# EAGLE design GEVCU 3 (EAGLE 6.1)
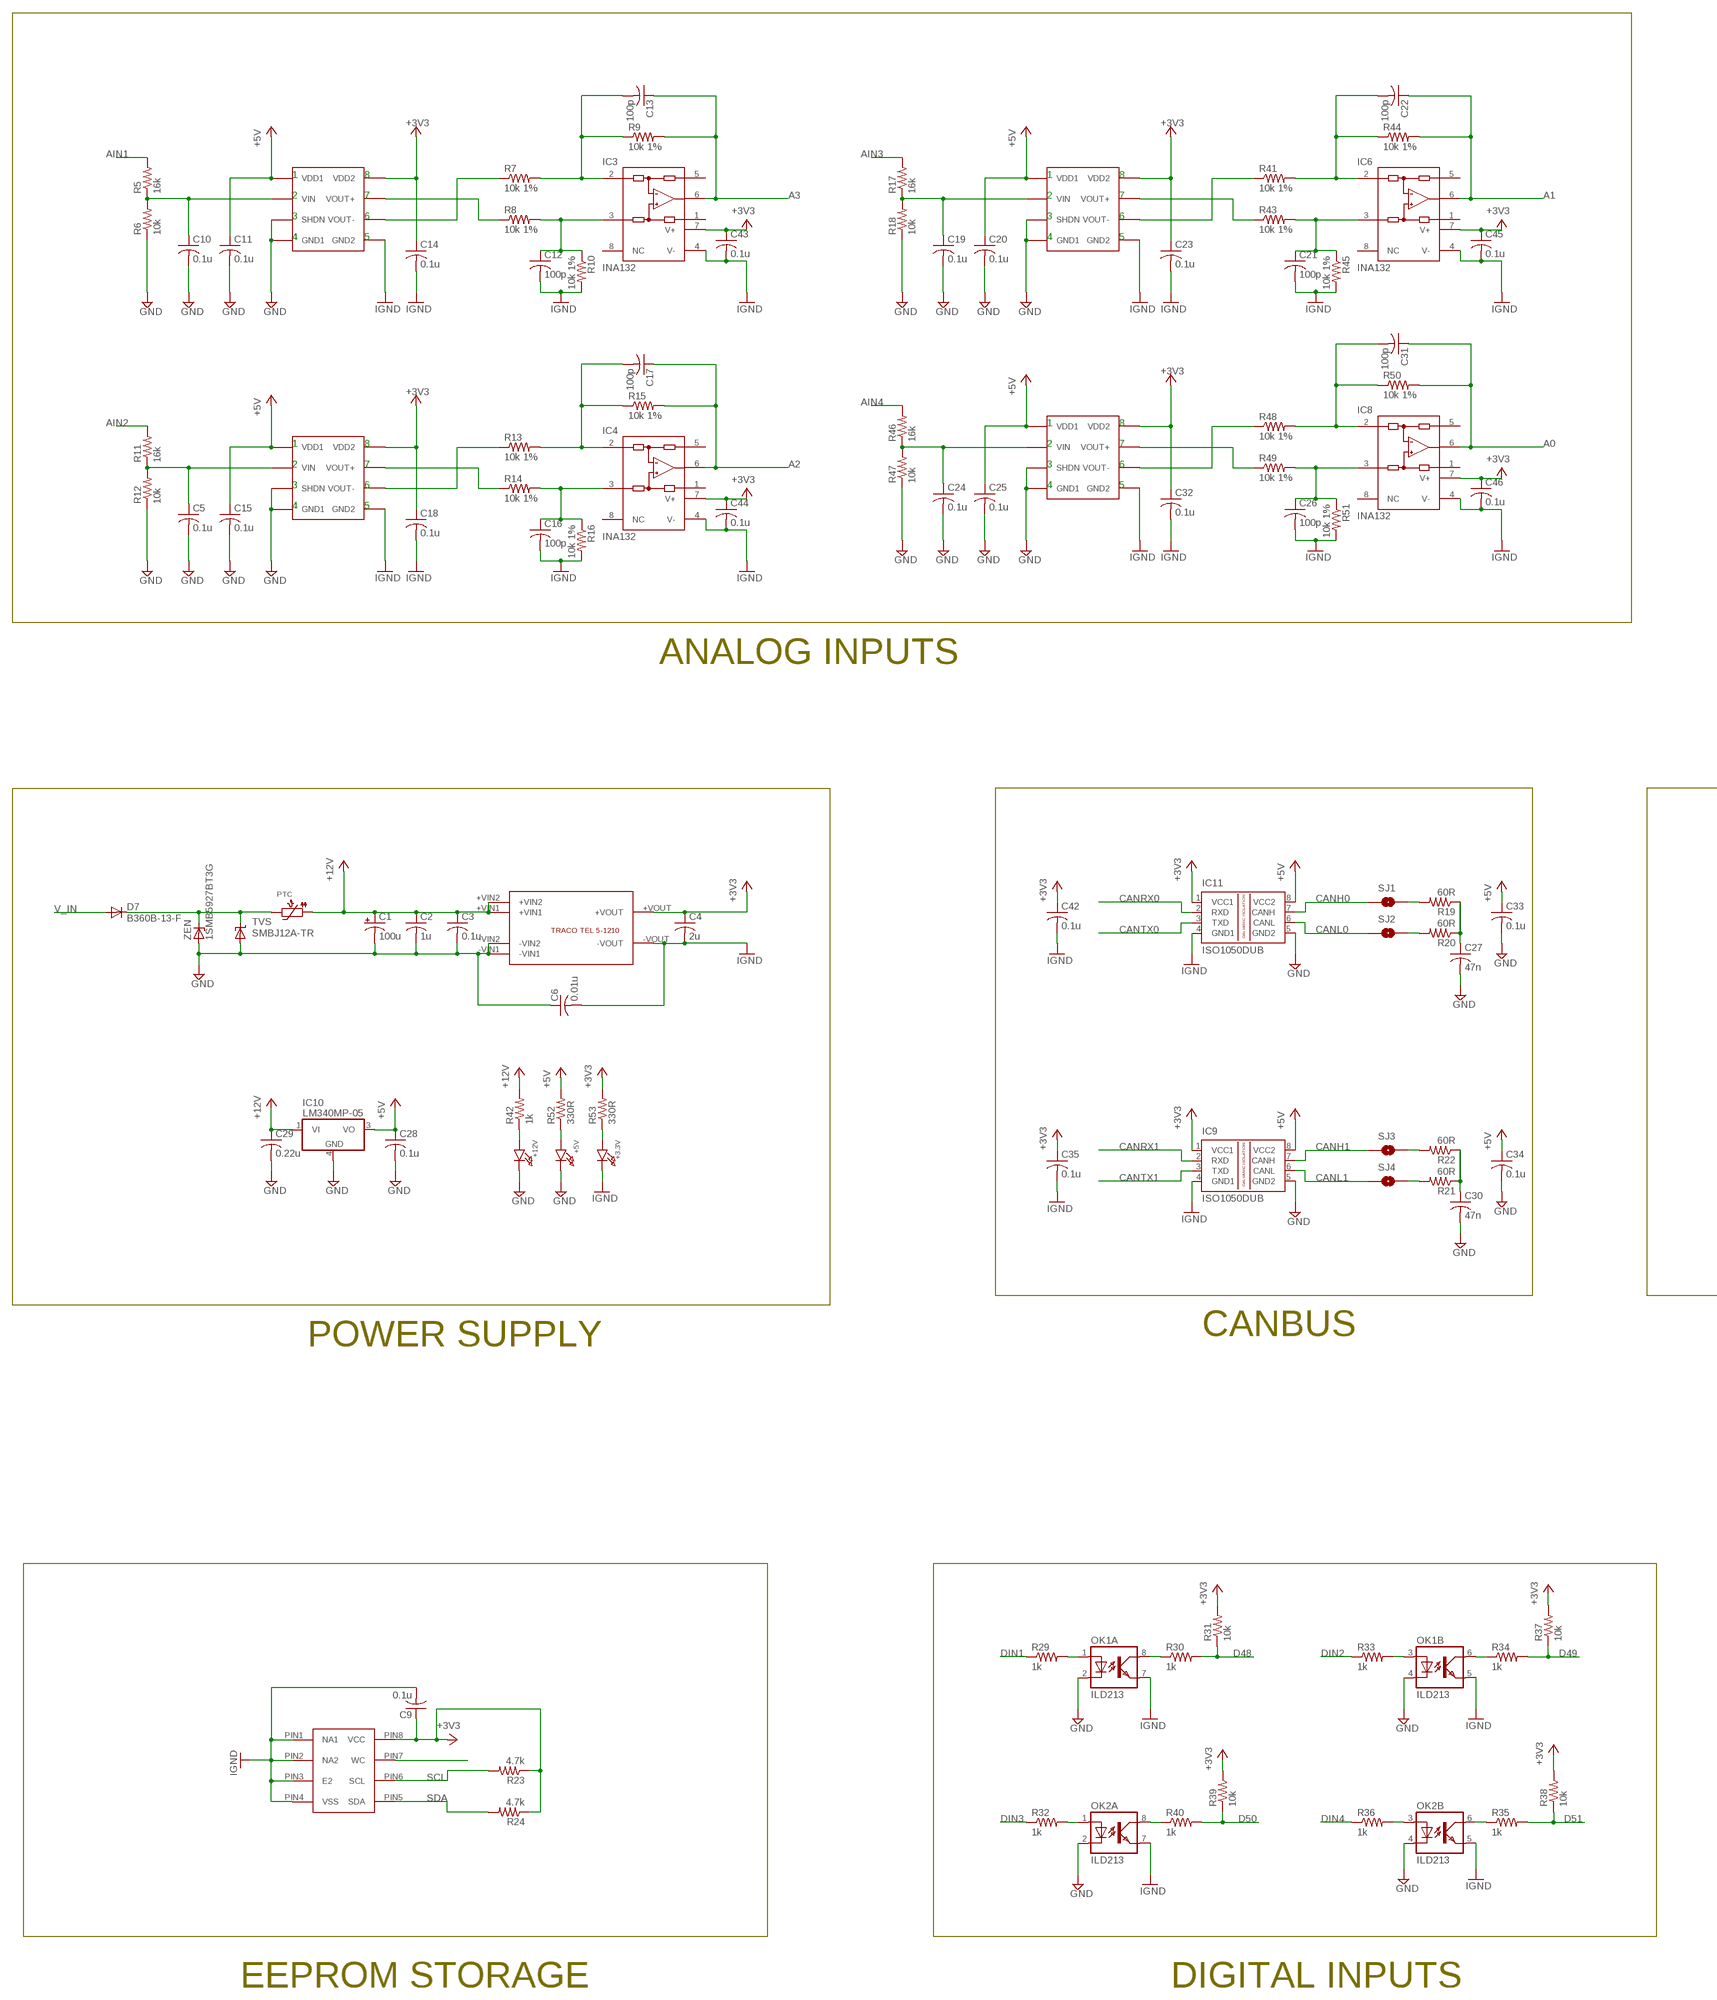
[diagram p0: schematic, sheet 1, part 1 of 2]
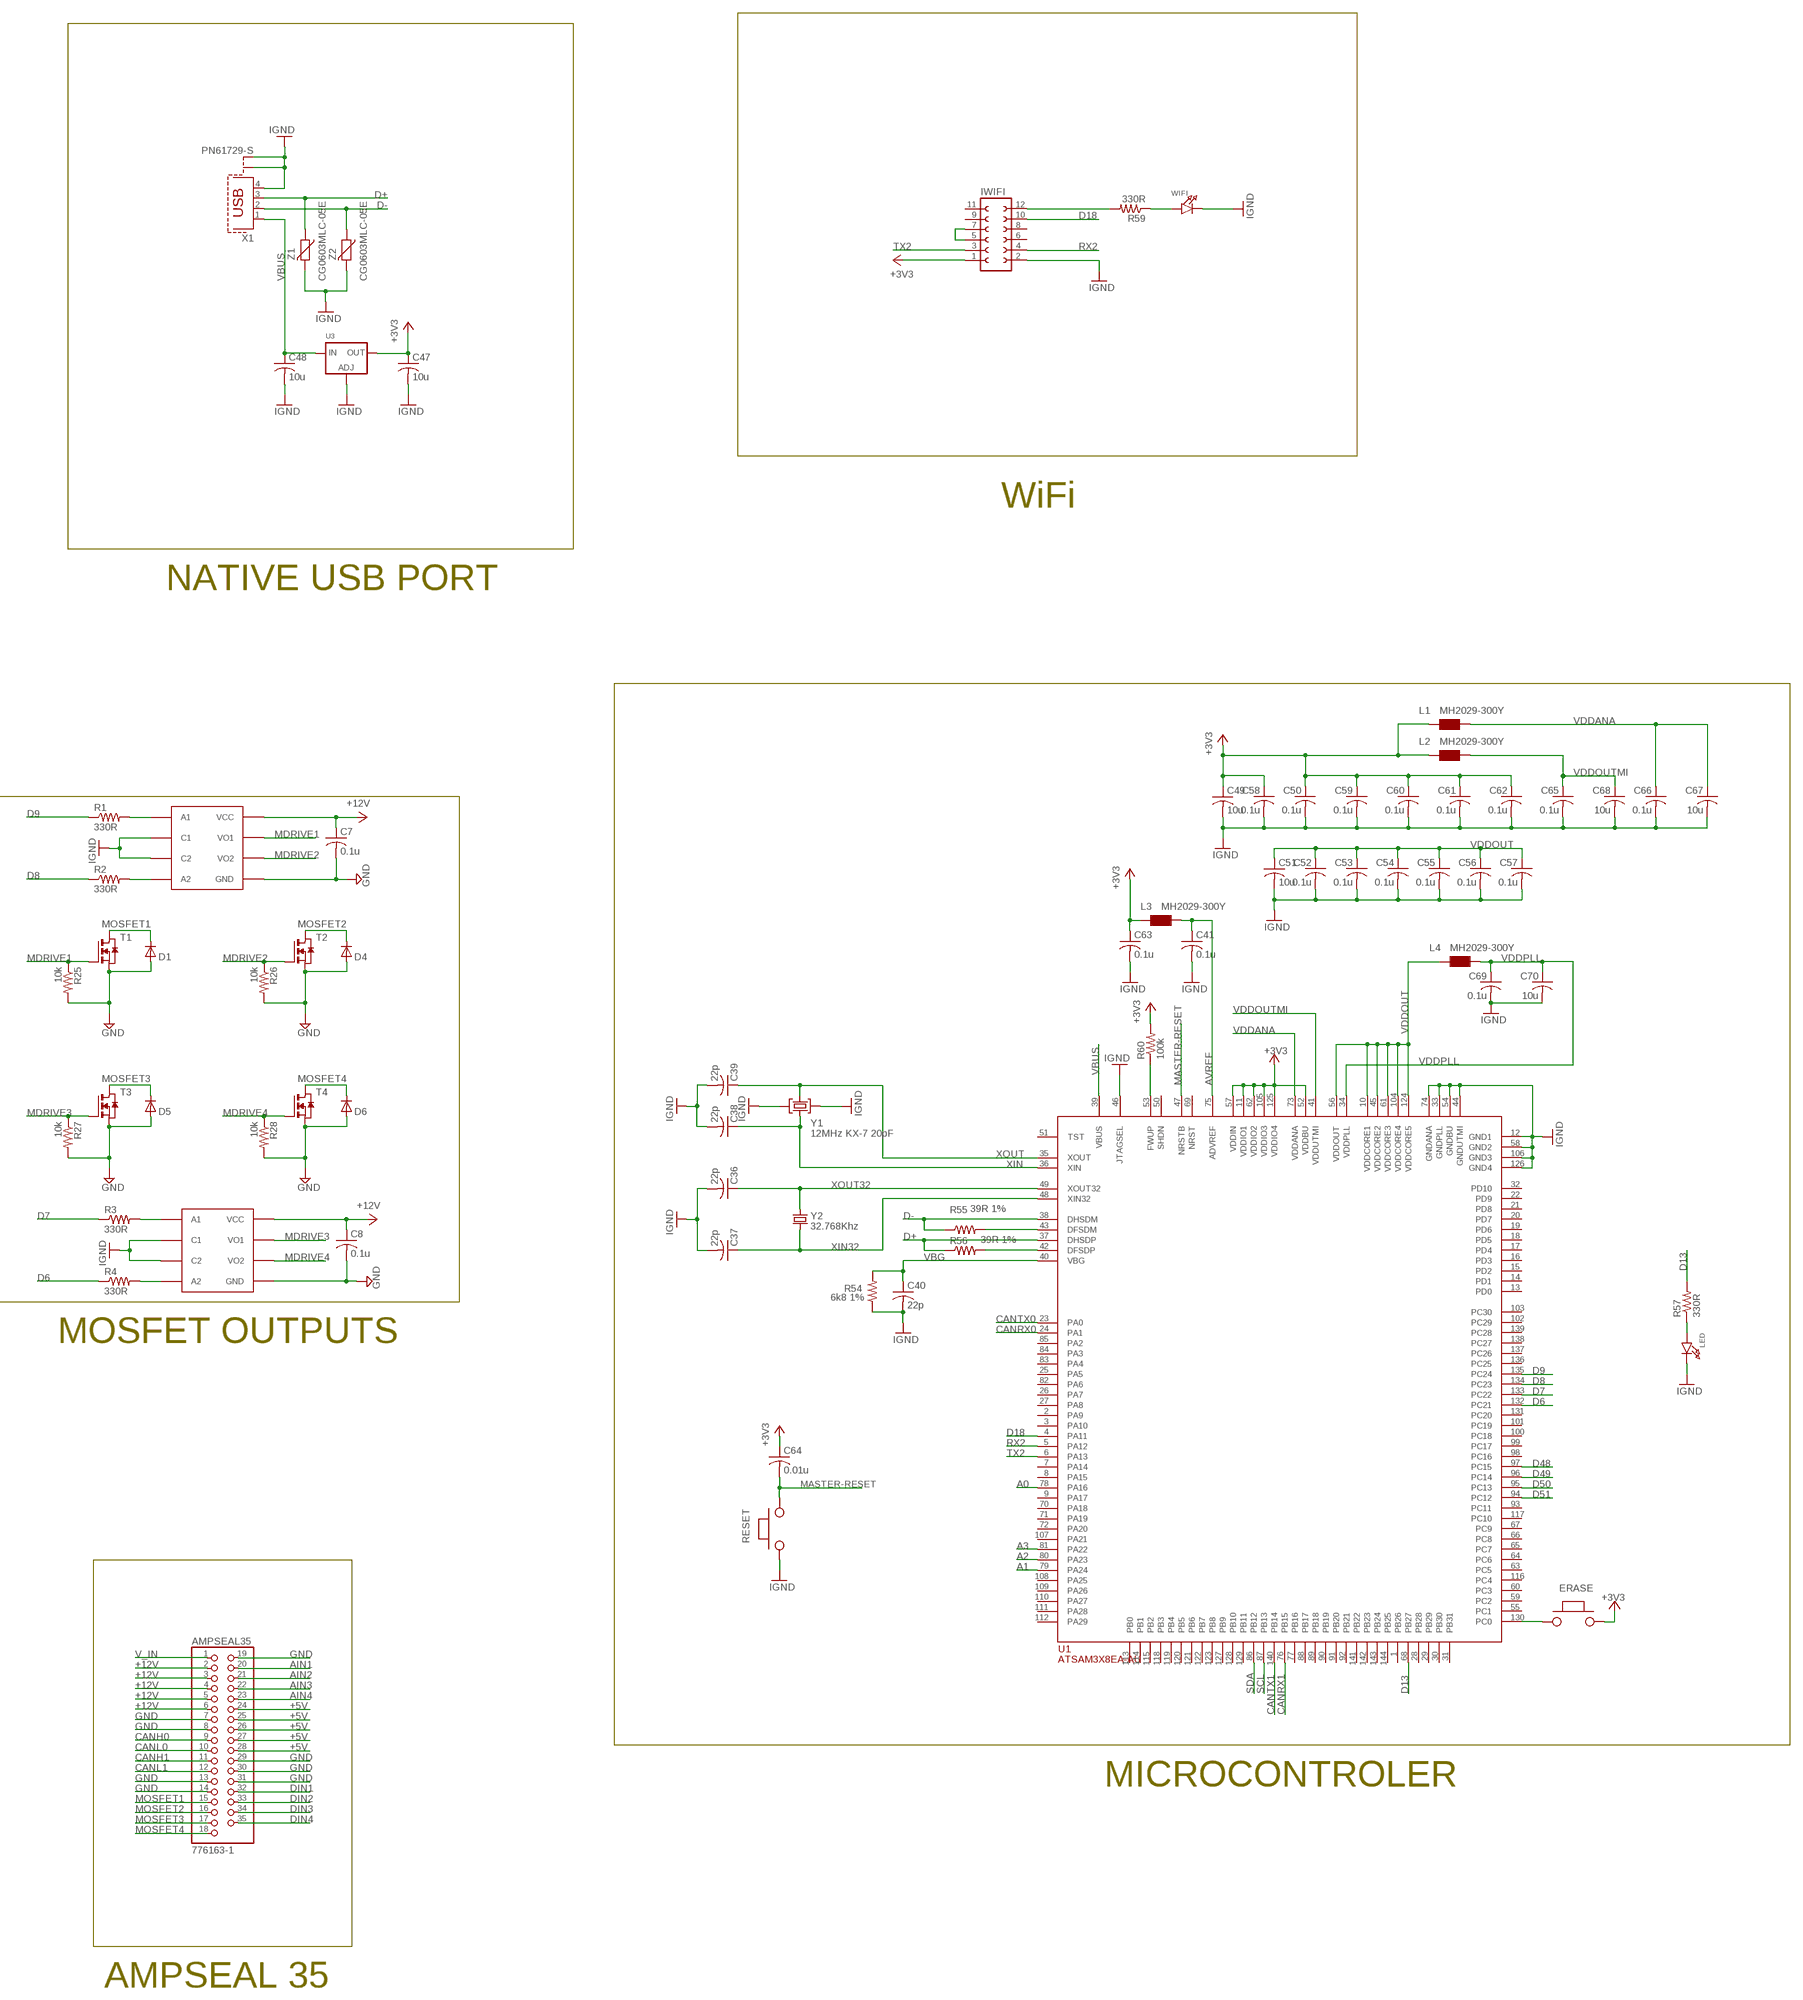
[diagram p1: schematic, sheet 1, part 2 of 2]

## Parts
+3.3V  LED0805  [CHIPLED_0805]
+5V  LED0805  [CHIPLED_0805]
+12V  LED0805  [CHIPLED_0805]
AMPSEAL35  776163-1  AMPSEAL35  [AMPSEAL35]
C1  100u  CPOL-USE2.5-6  [E2,5-6]
C2  1u  C-USC0805  [C0805]
C3  0.1u  C-USC0805  [C0805]
C4  2u  C-USC0805  [C0805]
C5  0.1u  C-USC0805  [C0805]
C6  0.01u  C-USC1812  [C1812]
C7  0.1u  C-USC0805  [C0805]
C8  0.1u  C-USC0805  [C0805]
C9  0.1u  C-USC0805  [C0805]
C10  0.1u  C-USC0805  [C0805]
C11  0.1u  C-USC1206  [C1206]
C12  100p  C-USC0805  [C0805]
C13  100p  C-USC0805  [C0805]
C14  0.1u  C-USC0805  [C0805]
C15  0.1u  C-USC1206  [C1206]
C16  100p  C-USC0805  [C0805]
C17  100p  C-USC0805  [C0805]
C18  0.1u  C-USC0805  [C0805]
C19  0.1u  C-USC0805  [C0805]
C20  0.1u  C-USC1206  [C1206]
C21  100p  C-USC0805  [C0805]
C22  100p  C-USC0805  [C0805]
C23  0.1u  C-USC0805  [C0805]
C24  0.1u  C-USC0805  [C0805]
C25  0.1u  C-USC1206  [C1206]
C26  100p  C-USC0805  [C0805]
C27  47n  C-USC0805  [C0805]
C28  0.1u  C-USC0805  [C0805]
C29  0.22u  C-USC0805  [C0805]
C30  47n  C-USC0805  [C0805]
C31  100p  C-USC0805  [C0805]
C32  0.1u  C-USC0805  [C0805]
C33  0.1u  C-USC0805  [C0805]
C34  0.1u  C-USC0805  [C0805]
C35  0.1u  C-USC0805  [C0805]
C36  22p  C-USC0805  [C0805]
C37  22p  C-USC0805  [C0805]
C38  22p  C-USC1206  [C1206]
C39  22p  C-USC1206  [C1206]
C40  22p  C-USC0805  [C0805]
C41  0.1u  C-USC0805  [C0805]
C42  0.1u  C-USC0805  [C0805]
C43  0.1u  C-USC0805  [C0805]
C44  0.1u  C-USC0805  [C0805]
C45  0.1u  C-USC0805  [C0805]
C46  0.1u  C-USC0805  [C0805]
C47  10u  C-USC0805  [C0805]
C48  10u  C-USC0805  [C0805]
C49  10u  C-USC0805  [C0805]
C50  0.1u  C-USC0805  [C0805]
C51  10u  C-USC0805  [C0805]
C52  0.1u  C-USC0805  [C0805]
C53  0.1u  C-USC0805  [C0805]
C54  0.1u  C-USC0805  [C0805]
C55  0.1u  C-USC0805  [C0805]
C56  0.1u  C-USC0805  [C0805]
C57  0.1u  C-USC0805  [C0805]
C58  0.1u  C-USC0805  [C0805]
C59  0.1u  C-USC0805  [C0805]
C60  0.1u  C-USC0805  [C0805]
C61  0.1u  C-USC0805  [C0805]
C62  0.1u  C-USC0805  [C0805]
C63  0.1u  C-USC0805  [C0805]
C64  0.01u  C-USC0805  [C0805]
C65  0.1u  C-USC0805  [C0805]
C66  0.1u  C-USC0805  [C0805]
C67  10u  C-USC0805  [C0805]
C68  10u  C-USC0805  [C0805]
C69  0.1u  C-USC0805  [C0805]
C70  10u  C-USC0805  [C0805]
D1  MBR0520LT  [SOD123]
D4  MBR0520LT  [SOD123]
D5  MBR0520LT  [SOD123]
D6  MBR0520LT  [SOD123]
D7  B360B-13-F  DIODE-SMB  [SMB]
ERASE  PUCHBUTTON  [PUCHBUTTON]
IC1  ACPL-C87A-000E  [SO8-WIDE]
IC2  ACPL-C87A-000E  [SO8-WIDE]
IC3  INA132  INA105U  [SO08]
IC4  INA132  INA105U  [SO08]
IC5  ACPL-C87A-000E  [SO8-WIDE]
IC6  INA132  INA105U  [SO08]
IC7  ACPL-C87A-000E  [SO8-WIDE]
IC8  INA132  INA105U  [SO08]
IC9  ISO1050DUB  [DUB-R-PDSO-G8]
IC10  LM340MP-05  [SOT223]
IC11  ISO1050DUB  [DUB-R-PDSO-G8]
IWIFI  FE06-2  [FE06-2]
L1  MH2029-300Y  WE-CBF_0805  [0805]
L2  MH2029-300Y  WE-CBF_0805  [0805]
L3  MH2029-300Y  WE-CBF_0805  [0805]
L4  MH2029-300Y  WE-CBF_0805  [0805]
LED  LED0805  [CHIPLED_0805]
OK1  ILD213  [SOIC08]
OK2  ILD213  [SOIC08]
PTC  PTC1812  [PTC1812]
R1  330R  R-US_R0805  [R0805]
R2  330R  R-US_R0805  [R0805]
R3  330R  R-US_R0805  [R0805]
R4  330R  R-US_R0805  [R0805]
R5  16k  R-US_R0805  [R0805]
R6  10k  R-US_R0805  [R0805]
R7  10k 1%  R-US_R0805  [R0805]
R8  10k 1%  R-US_R0805  [R0805]
R9  10k 1%  R-US_R0805  [R0805]
R10  10k 1%  R-US_R0805  [R0805]
R11  16k  R-US_R0805  [R0805]
R12  10k  R-US_R0805  [R0805]
R13  10k 1%  R-US_R0805  [R0805]
R14  10k 1%  R-US_R0805  [R0805]
R15  10k 1%  R-US_R0805  [R0805]
R16  10k 1%  R-US_R0805  [R0805]
R17  16k  R-US_R0805  [R0805]
R18  10k  R-US_R0805  [R0805]
R19  60R  R-US_R0805  [R0805]
R20  60R  R-US_R0805  [R0805]
R21  60R  R-US_R0805  [R0805]
R22  60R  R-US_R0805  [R0805]
R23  4.7k  R-US_R0805  [R0805]
R24  4.7k  R-US_R0805  [R0805]
R25  10k  R-US_R0805  [R0805]
R26  10k  R-US_R0805  [R0805]
R27  10k  R-US_R0805  [R0805]
R28  10k  R-US_R0805  [R0805]
R29  1k  R-US_R0805  [R0805]
R30  1k  R-US_R0805  [R0805]
R31  10k  R-US_R0805  [R0805]
R32  1k  R-US_R0805  [R0805]
R33  1k  R-US_R0805  [R0805]
R34  1k  R-US_R0805  [R0805]
R35  1k  R-US_R0805  [R0805]
R36  1k  R-US_R0805  [R0805]
R37  10k  R-US_R0805  [R0805]
R38  10k  R-US_R0805  [R0805]
R39  10k  R-US_R0805  [R0805]
R40  1k  R-US_R0805  [R0805]
R41  10k 1%  R-US_R0805  [R0805]
R42  1k  R-US_R0805  [R0805]
R43  10k 1%  R-US_R0805  [R0805]
R44  10k 1%  R-US_R0805  [R0805]
R45  10k 1%  R-US_R0805  [R0805]
R46  16k  R-US_R0805  [R0805]
R47  10k  R-US_R0805  [R0805]
R48  10k 1%  R-US_R0805  [R0805]
R49  10k 1%  R-US_R0805  [R0805]
R50  10k 1%  R-US_R0805  [R0805]
R51  10k 1%  R-US_R0805  [R0805]
R52  330R  R-US_R0805  [R0805]
R53  330R  R-US_R0805  [R0805]
R54  6k8 1%  R-US_R0805  [R0805]
R55  39R 1%  R-US_R0805  [R0805]
R56  39R 1%  R-US_R0805  [R0805]
R57  330R  R-US_R0805  [R0805]
R59  330R  R-US_R0805  [R0805]
R60  100k  R-US_R0805  [R0805]
RESET  PUCHBUTTON  [PUCHBUTTON]
SJ1  SOLDERJUMPERNO  [SJ_2S-NO]
SJ2  SOLDERJUMPERNO  [SJ_2S-NO]
SJ3  SOLDERJUMPERNO  [SJ_2S-NO]
SJ4  SOLDERJUMPERNO  [SJ_2S-NO]
T1  NMOSSOT223  [SOT223]
T2  NMOSSOT223  [SOT223]
T3  NMOSSOT223  [SOT223]
T4  NMOSSOT223  [SOT223]
TVS  SMBJ12A-TR  SUPPRESSOR-SMBJ  [SMBJ]
U1  ATSAM3X8EA-AU  ATSAM3X/AAU  [LQFP144]
U3  LM1117SOT223-WAVE  [SOT223-W]
U4  SFH6731  [DIP8]
U5  SFH6731  [DIP8]
U6  M24M02-DRMN6TP  [SOIC8]
U$2  TRACO  [TRACO]
WIFI  LED0805  [CHIPLED_0805]
X1  PN61729-S  [PN61729-S]
Y1  12MHz KX-7 20pF  CRYSTAL-3.2-2.5  [CRYSTAL-3.2-2.5]
Y2  32.768Khz  RESONATOR_EPSON_FC_145  [RESONATOR_EPSON_FC_145]
Z1  CG0603MLC-05E  VARISTORCN0603  [CT/CN0603]
Z2  CG0603MLC-05E  VARISTORCN0603  [CT/CN0603]
ZEN  1SMB5927BT3G  ZENER-DIODESMB  [SMB]

## Nets
+3V3: C4.1 C9.1 C14.1 C18.1 C23.1 C32.1 C35.1 C42.1 C43.1 C44.1 C45.1 C46.1 C47.1 C49.1 C50.1 C58.1 C59.1 C60.1 C61.1 C62.1 C63.1 C64.1 ERASE.P$2 IC1.8(VDD2) IC2.8(VDD2) IC3.7(V+) IC4.7(V+) IC5.8(VDD2) IC6.7(V+) IC7.8(VDD2) IC8.7(V+) IC9.1(VCC1) IC11.1(VCC1) IWIFI.1 L1.1 L2.1 L3.1 R23.1 R24.1 R31.2 R37.2 R38.2 R39.2 R53.2 R60.2 U1.11(VDDIO1) U1.52(VDDBU) U1.57(VDDIN) U1.62(VDDIO2) U1.105(VDDIO3) U1.125(VDDIO4) U3.2(OUT) U6.PIN8(VCC) U$2.+VOUT
+5V: AMPSEAL35.24 AMPSEAL35.25 AMPSEAL35.26 AMPSEAL35.27 AMPSEAL35.28 C11.1 C15.1 C20.1 C25.1 C28.1 C33.1 C34.1 IC1.1(VDD1) IC2.1(VDD1) IC5.1(VDD1) IC7.1(VDD1) IC9.8(VCC2) IC10.3(VO) IC11.8(VCC2) R52.2
+12V: AMPSEAL35.2 AMPSEAL35.3 AMPSEAL35.4 AMPSEAL35.5 AMPSEAL35.6 C1.+ C2.1 C3.1 C7.1 C8.1 C29.1 IC10.1(VI) PTC.P$1 R42.2 U4.8(VCC) U5.8(VCC) U$2.+VIN1 U$2.+VIN2
A0: C31.1 IC8.6(OUT) R50.2 U1.78(PA16)
A1: C22.1 IC6.6(OUT) R44.2 U1.79(PA24)
A2: C17.1 IC4.6(OUT) R15.2 U1.80(PA23)
A3: C13.1 IC3.6(OUT) R9.2 U1.81(PA22)
AIN1: AMPSEAL35.20 R5.2
AIN2: AMPSEAL35.21 R11.2
AIN3: AMPSEAL35.22 R17.2
AIN4: AMPSEAL35.23 R46.2
AVREF: C41.1 L3.2 U1.75(ADVREF)
CANH0: AMPSEAL35.9 IC11.7(CANH) SJ1.1
CANH1: AMPSEAL35.11 IC9.7(CANH) SJ3.1
CANL0: AMPSEAL35.10 IC11.6(CANL) SJ2.1
CANL1: AMPSEAL35.12 IC9.6(CANL) SJ4.1
CANRX0: IC11.2(RXD) U1.24(PA1)
CANRX1: IC9.2(RXD) U1.76(PB15)
CANTX0: IC11.3(TXD) U1.23(PA0)
CANTX1: IC9.3(TXD) U1.140(PB14)
D6: R4.1 U1.132(PC21)
D7: R3.1 U1.133(PC22)
D8: R2.1 U1.134(PC23)
D9: R1.1 U1.135(PC24)
D13: R57.2 U1.68(PB27)
D18: IWIFI.10 U1.4(PA11)
D48: R30.2 R31.1 U1.97(PC15)
D49: R34.2 R37.1 U1.96(PC14)
D50: R39.1 R40.2 U1.95(PC13)
D51: R35.2 R38.1 U1.94(PC12)
D+ [USB]: R56.1 U1.37(DHSDP) X1.3 Z1.1
D- [USB]: R55.1 U1.38(DHSDM) X1.2 Z2.1
DIN1: AMPSEAL35.32 R29.1
DIN2: AMPSEAL35.33 R33.1
DIN3: AMPSEAL35.34 R32.1
DIN4: AMPSEAL35.35 R36.1
ERASE_S: ERASE.P$1 U1.130(PC0)
GND: +5V.C +12V.C AMPSEAL35.7 AMPSEAL35.8 AMPSEAL35.13 AMPSEAL35.14 AMPSEAL35.19 AMPSEAL35.29 AMPSEAL35.30 AMPSEAL35.31 C1.- C2.2 C3.2 C5.2 C6.1 C7.2 C8.2 C10.2 C11.2 C15.2 C19.2 C20.2 C24.2 C25.2 C27.2 C28.2 C29.2 C30.2 C33.2 C34.2 D1.A D4.A D5.A D6.A IC1.3(SHDN) IC1.4(GND1) IC2.3(SHDN) IC2.4(GND1) IC5.3(SHDN) IC5.4(GND1) IC7.3(SHDN) IC7.4(GND1) IC9.5(GND2) IC10.4(GND) IC11.5(GND2) OK1.2(A:C) OK1.4(B:C) OK2.2(A:C) OK2.4(B:C) R6.1 R12.1 R18.1 R25.2 R26.2 R27.2 R28.2 R47.1 T1.3(S) T2.3(S) T3.3(S) T4.3(S) TVS.A U4.5(GND) U5.5(GND) U$2.-VIN1 U$2.-VIN2 ZEN.A
IGND: +3.3V.C C4.2 C6.2 C9.2 C12.2 C14.2 C16.2 C18.2 C21.2 C23.2 C26.2 C32.2 C35.2 C36.2 C37.2 C38.2 C39.2 C40.2 C41.2 C42.2 C43.2 C44.2 C45.2 C46.2 C47.2 C48.2 C49.2 C50.2 C51.2 C52.2 C53.2 C54.2 C55.2 C56.2 C57.2 C58.2 C59.2 C60.2 C61.2 C62.2 C63.2 C65.2 C66.2 C67.2 C68.2 C69.2 C70.2 IC1.5(GND2) IC2.5(GND2) IC3.4(V-) IC4.4(V-) IC5.5(GND2) IC6.4(V-) IC7.5(GND2) IC8.4(V-) IC9.4(GND1) IC11.4(GND1) IWIFI.2 LED.C OK1.5(B:EMIT) OK1.7(A:EMIT) OK2.5(B:EMIT) OK2.7(A:EMIT) R10.2 R16.2 R45.2 R51.2 R54.1 RESET.P$1 U1.12(GND1) U1.33(GNDPLL) U1.44(GNDUTMI) U1.46(JTAGSEL) U1.54(GNDBU) U1.58(GND2) U1.74(GNDANA) U1.106(GND3) U1.126(GND4) U3.1(ADJ) U4.2(C1) U4.3(C2) U5.2(C1) U5.3(C2) U6.PIN1(NA1) U6.PIN2(NA2) U6.PIN3(E2) U6.PIN4(VSS) U$2.-VOUT WIFI.C X1.4 X1.S1 X1.S2 Y1.2(GND) Y1.4(GND) Z1.2 Z2.2
MASTER-RESET: C64.2 RESET.P$2 U1.47(NRSTB)
MDRIVE1: R25.1 T1.1(G) U5.7(VO1)
MDRIVE2: R26.1 T2.1(G) U5.6(VO2)
MDRIVE3: R27.1 T3.1(G) U4.7(VO1)
MDRIVE4: R28.1 T4.1(G) U4.6(VO2)
MOSFET1: AMPSEAL35.15 D1.C T1.2(D) T1.4(D)
MOSFET2: AMPSEAL35.16 D4.C T2.2(D) T2.4(D)
MOSFET3: AMPSEAL35.17 D5.C T3.2(D) T3.4(D)
MOSFET4: AMPSEAL35.18 D6.C T4.2(D) T4.4(D)
N$1: C10.1 IC1.2(VIN) R5.1 R6.2
N$2: +3.3V.A R53.1
N$3: D7.C PTC.P$2 TVS.C ZEN.C
N$4: +5V.A R52.1
N$5: R3.2 U4.1(A1)
N$6: LED.A R57.1
N$7: R1.2 U5.1(A1)
N$8: IC2.7(VOUT+) R14.1
N$9: IC2.6(VOUT-) R13.1
N$10: R2.2 U5.4(A2)
N$11: R4.2 U4.4(A2)
N$12: C17.2 IC4.2(-IN) R13.2 R15.1
N$13: IC1.7(VOUT+) R8.1
N$14: IC1.6(VOUT-) R7.1
N$15: C13.2 IC3.2(-IN) R7.2 R9.1
N$16: C12.1 IC3.3(+IN) R8.2 R10.1
N$17: C16.1 IC4.3(+IN) R14.2 R16.1
N$18: C5.1 IC2.2(VIN) R11.1 R12.2
N$19: IC5.7(VOUT+) R43.1
N$20: IC5.6(VOUT-) R41.1
N$21: C22.2 IC6.2(-IN) R41.2 R44.1
N$22: C21.1 IC6.3(+IN) R43.2 R45.1
N$23: C19.1 IC5.2(VIN) R17.1 R18.2
N$24: C27.1 R19.1 R20.1
N$25: IC7.7(VOUT+) R49.1
N$26: R19.2 SJ1.2
N$27: R20.2 SJ2.2
N$28: R21.2 SJ4.2
N$29: C30.1 R21.1 R22.1
N$30: R22.2 SJ3.2
N$31: OK1.1(A:A) R29.2
N$32: OK1.3(B:A) R33.2
N$33: OK1.8(A:COL) R30.1
N$34: OK1.6(B:COL) R34.1
N$35: IC7.6(VOUT-) R48.1
N$36: OK2.6(B:COL) R35.1
N$37: C31.2 IC8.2(-IN) R48.2 R50.1
N$38: OK2.8(A:COL) R40.1
N$39: C26.1 IC8.3(+IN) R49.2 R51.1
N$40: OK2.1(A:A) R32.2
N$41: C24.1 IC7.2(VIN) R46.1 R47.2
N$43: OK2.3(B:A) R36.2
N$44: +12V.A R42.1
N$45: IWIFI.12 R59.2
N$46: R59.1 WIFI.A
N$49: IWIFI.5 IWIFI.7
N$53: R55.2 U1.43(DFSDM)
N$56: R56.2 U1.42(DFSDP)
N$59: R60.1 U1.53(FWUP)
RX2: IWIFI.4 U1.5(PA12)
RXD1: U6.PIN7(WC)
SCL: R23.2 U1.87(PB13) U6.PIN6(SCL)
SDA: R24.2 U1.86(PB12) U6.PIN5(SDA)
TX2: IWIFI.3 U1.6(PA13)
V_IN: AMPSEAL35.1 D7.A
VBG: C40.1 R54.2 U1.40(VBG)
VBUS [usbvcc]: C48.1 U1.39(VBUS) U3.3(IN) X1.1
VDDANA: C66.1 C67.1 L1.2
VDDOUT: C51.1 C52.1 C53.1 C54.1 C55.1 C56.1 C57.1 L4.1 U1.10(VDDCORE1) U1.45(VDDCORE2) U1.56(VDDOUT) U1.61(VDDCORE3) U1.104(VDDCORE4) U1.124(VDDCORE5)
VDDOUTMI: C65.1 C68.1 L2.2 U1.41(VDDUTMI)
VDDPLL: C69.1 C70.1 L4.2 U1.34(VDDPLL)
XIN: C38.1 U1.36(XIN) Y1.1(C1)
XIN32: C37.1 U1.48(XIN32) Y2.P$2
XOUT: C39.1 U1.35(XOUT) Y1.3(C2)
XOUT32: C36.1 U1.49(XOUT32) Y2.P$1
Unconnected: IC3.1(REF) IC3.5(SENSE) IC3.8(NC) IC4.1(REF) IC4.5(SENSE) IC4.8(NC) IC6.1(REF) IC6.5(SENSE) IC6.8(NC) IC8.1(REF) IC8.5(SENSE) IC8.8(NC) IWIFI.6 IWIFI.8 IWIFI.9 IWIFI.11 U1.1(PB26) U1.2(PA9) U1.3(PA10) U1.7(PA14) U1.8(PA15) U1.9(PA17) U1.13(PD0) U1.14(PD1) U1.15(PD2) U1.16(PD3) U1.17(PD4) U1.18(PD5) U1.19(PD6) U1.20(PD7) U1.21(PD8) U1.22(PD9) U1.25(PA5) U1.26(PA7) U1.27(PA8) U1.28(PB28) U1.29(PB29) U1.30(PB30) U1.31(PB31) U1.32(PD10) U1.50(SHDN) U1.51(TST) U1.55(PC1) U1.59(PC2) U1.60(PC3) U1.63(PC5) U1.64(PC6) U1.65(PC7) U1.66(PC8) U1.67(PC9) U1.69(NRST) U1.70(PA18) U1.71(PA19) U1.72(PA20) U1.77(PB16) U1.82(PA6) U1.83(PA4) U1.84(PA3) U1.85(PA2) U1.88(PB17) U1.89(PB18) U1.90(PB19) U1.91(PB20) U1.92(PB21) U1.93(PC11) U1.98(PC16) U1.99(PC17) U1.100(PC18) U1.101(PC19) U1.102(PC29) U1.103(PC30) U1.107(PA21) U1.108(PA25) U1.109(PA26) U1.110(PA27) U1.111(PA28) U1.112(PA29) U1.113(PB0) U1.114(PB1) U1.115(PB2) U1.116(PC4) U1.117(PC10) U1.118(PB3) U1.119(PB4) U1.120(PB5) U1.121(PB6) U1.122(PB7) U1.123(PB8) U1.127(PB9) U1.128(PB10) U1.129(PB11) U1.131(PC20) U1.136(PC25) U1.137(PC26) U1.138(PC27) U1.139(PC28) U1.141(PB22) U1.142(PB23) U1.143(PB24) U1.144(PB25)

## Notes on the sheet
- 1 | 8 | 1 | 8
- 2 | 7 | 2 | 7
- 3 | 6 | 3 | 6
- 4 | 5 | 4 | 5
- 1 | 8
- 1 | 8 | 2 | 7
- 2 | 7 | 3 | 6
- 3 | 6 | 4 | 5
- WiFi
- 4 | 5
- NATIVE USB PORT
- ANALOG INPUTS
- POWER SUPPLY | CANBUS | MOSFET OUTPUTS
- MICROCONTROLER
- EEPROM STORAGE | DIGITAL INPUTS | AMPSEAL 35

## Power pins joined to a net without a drawn wire
VDDANA: U1.73(VDDANA)

## Library data of the parts
+3.3V +5V +12V LED WIFI = microbuilder:LED: LED 0603 - 0603 Surface Mount Package 2mA: Green LED - Low Power (3.9mcd, 2ma, 1.7Vf) - Digikey: 475-2709-2-ND Orange LED - Low Power (9.8mcd, 2ma, 1.8Vf) - Digikey: 475-1194-2-ND Red LED - Low Power (5mcd, 2ma, 1.8Vf) - Digikey: 475-1195-2-ND Yellow LED - Low Power (7mcd, 2ma, 1.8Vf) - Digikey: 475-1196-2-ND 5mA: Blue LED - Low Power (17mcd, 5ma, 2.9Vf) - Digikey: LNJ937W8CRACT-ND 0805 - 0805 Surface Mount Package 2mA: Red LED (8.8mcd, 2mA, 1.8Vf, Clear) - Low Power [Digikey: 475-2510-1-ND] Green LED (5mcd, 2mA, 1.8Vf, Clear) - Low Power [Digikey: 475-2730-1-ND] Yellow LED (11.3mcd, 2mA, 1.8Vf, Clear) - Low Power [Digikey: 475-2555-1-ND] 20mA: Red LED (104mcd, 20mA, Diffused) - LS R976 [Digikey: 475-1278-6-ND] Red LED (12mcd, 20mA, 2.0Vf, Clear) - APT2012EC [Digikey: 754-1128-1-ND] Green LED (15mcd, 20mA, 2.2Vf, Clear) - APT2012GC [Digikey: 754-1131-1-ND] Orange LED (160mcd, 20mA, 2.1Vf, Clear) - APT2012SECK [Digikey: 754-1130-1-ND] 1206 - 1206 Surface Mount Package Green LED (26mcd, 20mA, Diffused) - LG N971 [Digikey: 475-1407-6-ND] Red LED (15mcd, 20mA, Diffused) - LH N974 [Digikey: 475-1416-6-ND]
AMPSEAL35 = Ampseal:AMPSEAL35: Ampseal 35 pin PCB mount
C1 = rcl:CPOL-US: POLARIZED CAPACITOR, American symbol
C2-C70 = rcl:C-US: CAPACITOR, American symbol
D1 D4-D6 = diode:MBR0520LT: SCHOTTKY BARRIER RECTIFIER Source: http://onsemi.com .. MBR0520LT1-D.pdf
D7 = diode:DIODE-: DIODE
ERASE = PushButton:PUCHBUTTON; BUTTON: ERASE; ERASE: Erase
IC1 IC2 IC5 IC7 = ck_custom:ACPL-C87A-000E
IC3 IC4 IC6 IC8 = burr-brown:INA105: Precision Unity Gain Diff. Amplifier; MF: TEXAS INSTRUMENTS; MPN: INA105KU; OC_FARNELL: 1754832; OC_NEWARK: 35C0475
IC9 IC11 = texas:ISO1050: ISOLATED CAN TRANSCEIVER Source: http://focus.ti.com/lit/ds/symlink/iso1050.pdf; MPN: ISO1050DUBR; OC_FARNELL: 1755712; OC_NEWARK: 14R9899
IC10 = linear:LM340?-*: Positive VOLTAGE REGULATOR Source: http://cache.national.com/ds/LM/LM340.pdf
IWIFI = con-lsta:FE06-2: FEMALE HEADER; OC_FARNELL: unknown; OC_NEWARK: unknown
L1-L4 = wuerth-elektronik:WE-CBF: SMD EMI Suppression Ferrite Beads - excellent anti-EMI properties - low DCR - impedances till 3000 ohms - rated current up to 6 A
OK1 OK2 = optocoupler:ILD2*: Siemens ILD205/206/207/211/213/217 DUAL PHOTOTRANSISTOR SMALL OUTLINE SURFACE MOUNT OPTOCOUPLER Source: 153385-da-01-en-Optocoupler_ILD205-T.pdf; MF: VISHAY/TELEFUNKEN; MPN: ILD213T; OC_FARNELL: 1045451; OC_NEWARK: 20H8680
PTC = microbuilder:PTC: PTC (Resettable Fuse) 1206 Package 250mA PTC (16V Max, Time-to-Trip: 0.08s) - Digikey: F2110CT-ND 1210 Package 100mA PTC (30V Max, Time-to-Trip: 0.6s) - Digikey: MF-USMF010-2CT-ND 1812 Package 750mA PTC (24V Max, Time-to-Trip: 0.2s) - Digikey: MF-MSMF075/24-2CT-ND
R1-R57 R59 R60 = rcl:R-US_: RESISTOR, American symbol
RESET = PushButton:PUCHBUTTON; BUTTON: RESET; RESET: RESET
SJ1-SJ4 = SparkFun-Passives:SOLDERJUMPER: Solder Jumper Standard SMD solder jumper. Used to automate production. Two varients : Normally Open and Normally Closed are the same, but have different paste layers. NC will have a large amount of paste and should jumper during reflow.
T1-T4 = zetex:NMOSSOT223: MOS FET; OC_FARNELL: unknown; OC_NEWARK: unknown
TVS = diode:SUPPRESSOR-: Suppressor diode
U1 = SmartPrj:ATSAM3X/A
U3 = microbuilder:LM1117: LM1117 Voltage Regulator LM1117 Adjustable Voltage regulator [Digikey: LM1117IMP-ADJDKR-ND] LM1117 3.3V Voltage regulator [AP1117E33GDIDKR-ND] LM1117 5.0V Voltage regulator [AP1117E50GDIDKR-ND] SOT223-REFLOW - SOT223 package for solder paste/reflow ovens SOT223-WAVE - SOT223 package for hand-soldering (larger pads) Note: For the fixed-voltage regulators, simply set the ADJ pin to GND.
U4 U5 = ck_custom:SFH6731
U6 = ck_custom:M24M02-DRMN6TP
U$2 = Traco:TRACO
X1 = con-berg:PN61729-S: BERG USB connector; OC_FARNELL: unknown; OC_NEWARK: unknown
Y1 = SmartPrj:CRYSTAL-3.2-2.5
Y2 = Arduino_Wifi_shield_v018_tG:RESONATOR_EPSON_FC_145
Z1 Z2 = varistor:VARISTOR: VARISTOR
ZEN = diode:ZENER-DIODE: Z-Diode

## Net classes
0 default: width 0.203 mm, drill 0.305 mm, clearance 0.203 mm
1 USB: drill 0.406 mm, clearance 0.203 mm to class 0, clearance 0.406 mm
2 gnd: width 0.305 mm, drill 0.406 mm, clearance 0.203 mm to class 0, clearance 0.203 mm
3 usbvcc: width 0.61 mm, drill 0.508 mm, clearance 0.203 mm to class 0, clearance 0.254 mm

## Board
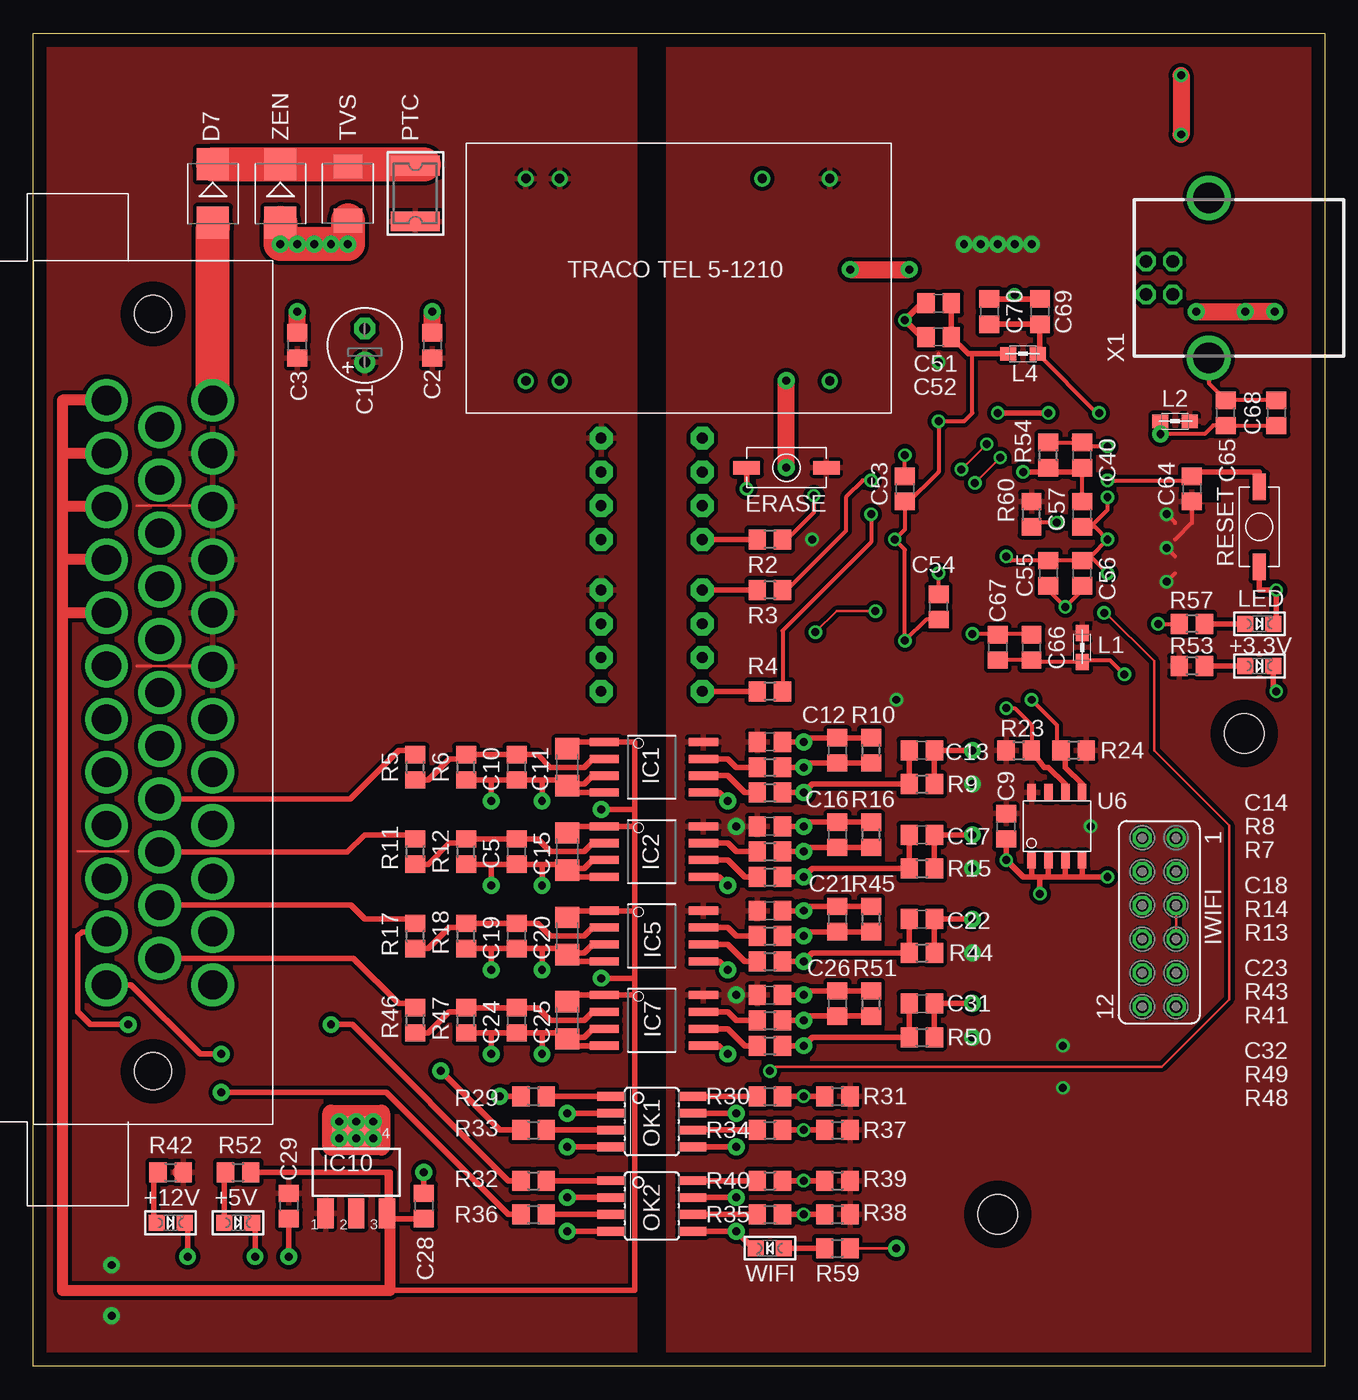
[diagram p2: board, top side]
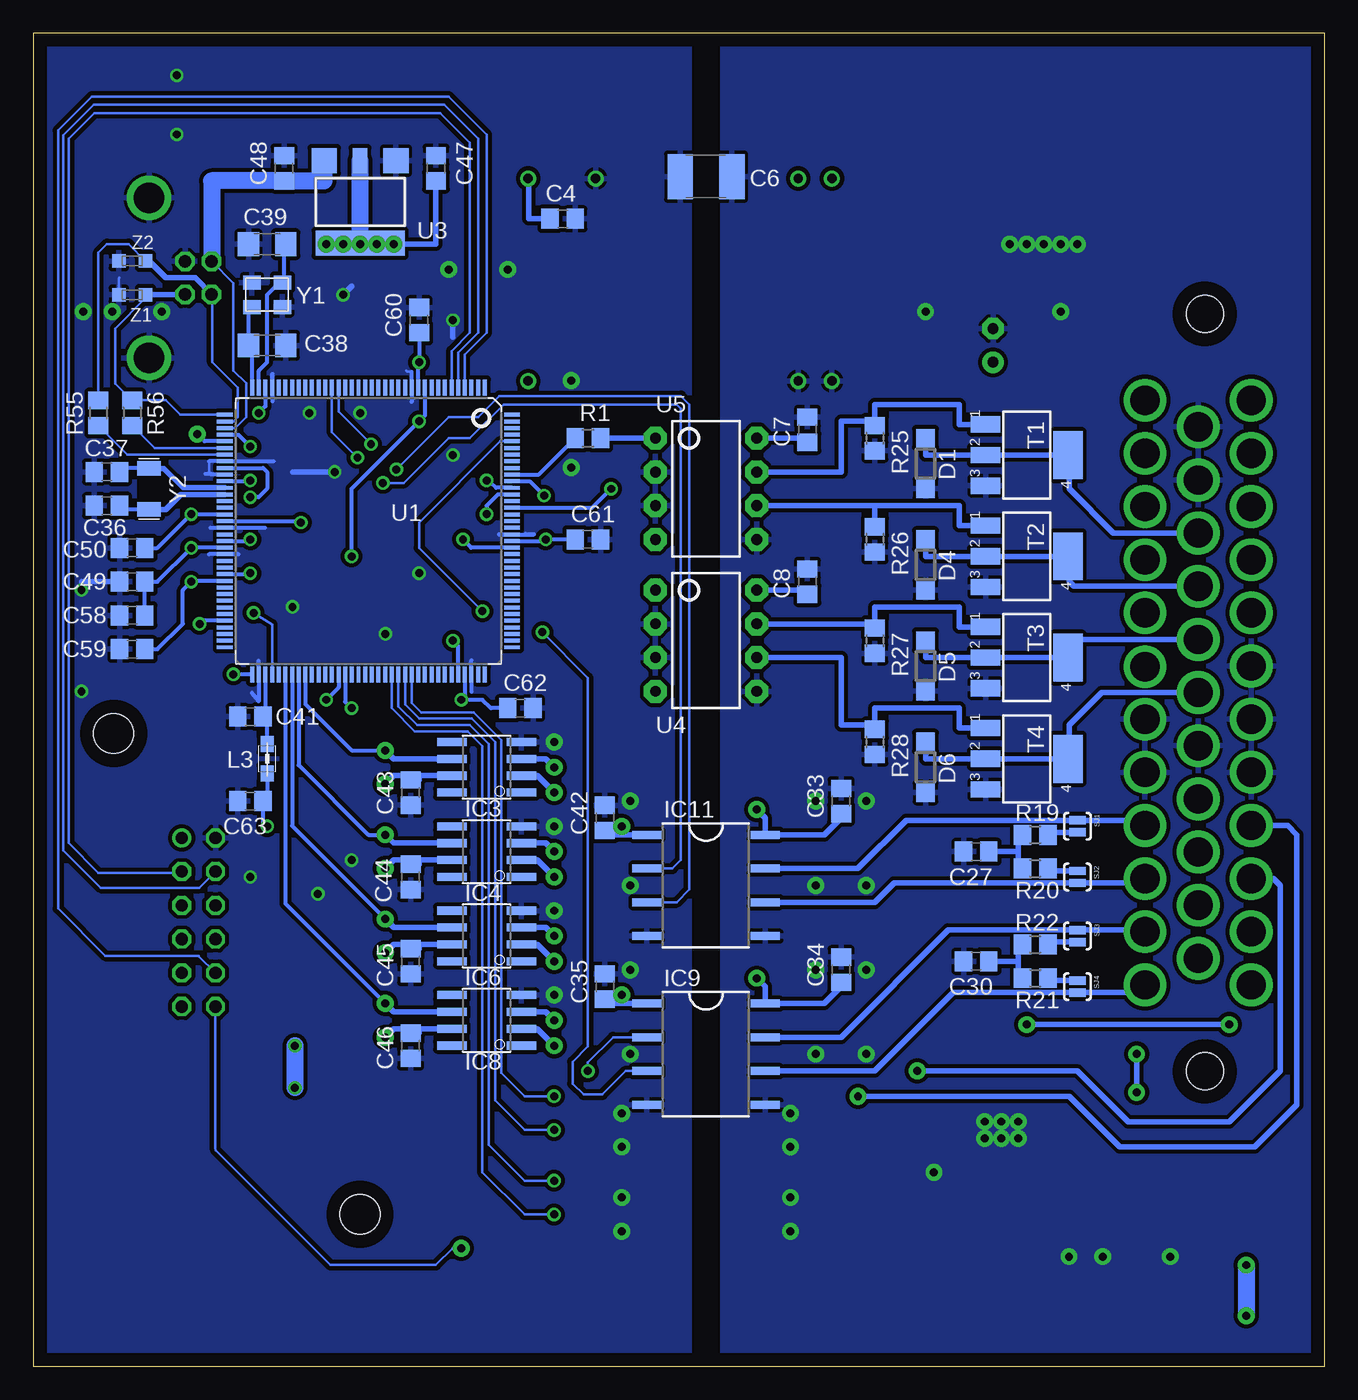
[diagram p3: board, bottom side, seen from below]

Size 97.16 x 100.33 mm. Coordinates in mm from the lower left corner, seen from the top.
Outline: 0,100.33 97.16,100.33 97.16,0 0,0 0,100.33
Copper layers (1*16): Top 0.035mm / dielectric 1.5mm / Bottom 0.035mm
Design rules: minimum track width 10mil, minimum drill 24mil, track to track 12mil, track to pad 12mil, pad to pad 12mil, via to via 12mil, smd to smd 12mil, copper to edge 40mil, drill to drill 8mil, minimum pad ring 10mil, minimum via ring 8mil, stop-mask expansion 0.1mm, vias tented up to drill 0.6mm, thermal gap 10mil
Holes 3 mm at 91.11,47.62 72.57,11.43

### Footprints (pad centres in the part's own frame; a part is rotated, then mirrored left to right if it is on the bottom)
CHIPLED_0805 = smd 1.2 x 1.2: A 0,-1.05; C 0,1.05
AMPSEAL35 = drill 2.2: 1 -20,0; 2 -16,0; 3 -12,0; 4 -8,0; 5 -4,0; 6 0.05,0; 7 4,0; 8 8,0; 9 12,0; 10 16,0; 11 20,0; 12 24,0; 13 -18,-4; 14 -14,-4; 15 -10,-4; 16 -6,-4; 17 -2,-4; 18 2,-4; 19 6,-4; 20 10,-4; 21 14,-4; 22 18,-4; 23 22,-4; 24 -20,-8; 25 -16,-8; 26 -12,-8; 27 -8,-8; 28 -4,-8; 29 0,-8; 30 4,-8; 31 8,-8; 32 12,-8; 33 16,-8; 34 20,-8; 35 24,-8 | hole 2.8: -26.5,-4.5; 30.5,-4.5
E2,5-6 = drill 0.813 pad 1.6: + -1.27,0 | drill 0.813 pad 1.6 octagon: - 1.27,0
C0805 = smd 1.3 x 1.5: 1 -0.95,0; 2 0.95,0
C1812 = smd 1.9 x 3.4: 1 -1.95,0; 2 1.95,0
C1206 = smd 1.6 x 1.8: 1 -1.4,0; 2 1.4,0
SOD123 = smd 1.4 x 1.4: A 1.9,0; C -1.9,0
SMB = smd 2.4 x 2.4: A 2.2,0; C -2.2,0
PUCHBUTTON = smd 2 x 1: P$1 3,0; P$2 -3,0
SO8-WIDE = smd 0.61 x 2.21: 1 0.635,-1.029; 2 1.905,-1.029; 3 3.175,-1.029; 4 4.445,-1.029; 5 4.445,6.426; 6 3.175,6.426; 7 1.905,6.426; 8 0.635,6.426
SO08 = smd 0.61 x 2.21: 1 -1.905,-2.616; 2 -0.635,-2.616; 3 0.635,-2.616; 4 1.905,-2.616; 5 1.905,2.616; 6 0.635,2.616; 7 -0.635,2.616; 8 -1.905,2.616
DUB-R-PDSO-G8 = smd 0.6 x 2.2: 1 -3.81,-4.445; 2 -1.27,-4.445; 3 1.27,-4.445; 4 3.81,-4.445; 5 3.81,4.445; 6 1.27,4.445; 7 -1.27,4.445; 8 -3.81,4.445
SOT223 = smd 1.219 x 2.235: 1 -2.311,-3.099; 2 0,-3.099; 3 2.311,-3.099 | smd 3.6 x 2.2: 4 0,3.099
FE06-2 = drill 0.914: 1 -6.35,1.27 | drill 0.914 octagon: 2 -6.35,-1.27; 3 -3.81,1.27; 4 -3.81,-1.27; 5 -1.27,1.27; 6 -1.27,-1.27; 7 1.27,1.27; 8 1.27,-1.27; 9 3.81,1.27; 10 3.81,-1.27; 11 6.35,1.27; 12 6.35,-1.27
0805 = smd 1.2 x 1: 1 -1.1,0; 2 1.1,0
SOIC08 = smd 0.66 x 2.032: 1 -1.905,-3.073; 2 -0.635,-3.073; 3 0.635,-3.073; 4 1.905,-3.073; 5 1.905,3.073; 6 0.635,3.073; 7 -0.635,3.073; 8 -1.905,3.073
PTC1812 = smd 1.5 x 3.7: P$1 -2.1,0; P$2 2.1,0
R0805 = smd 1.3 x 1.5: 1 -0.95,0; 2 0.95,0
SJ_2S-NO = smd 0.635 x 1.27: 1 -0.45,0; 2 0.45,0
SMBJ = smd 1.78 x 2.16: A 2.04,0; C -2.03,0
LQFP144 = smd 0.3 x 1.2: 1 -8.75,-10.8; 2 -8.25,-10.8; 3 -7.75,-10.8; 4 -7.25,-10.8; 5 -6.75,-10.8; 6 -6.25,-10.8; 7 -5.75,-10.8; 8 -5.25,-10.8; 9 -4.75,-10.8; 10 -4.25,-10.8; 11 -3.75,-10.8; 12 -3.25,-10.8; 13 -2.75,-10.8; 14 -2.25,-10.8; 15 -1.75,-10.8; 16 -1.25,-10.8; 17 -0.75,-10.8; 18 -0.25,-10.8; 19 0.25,-10.8; 20 0.75,-10.8; 21 1.25,-10.8; 22 1.75,-10.8; 23 2.25,-10.8; 24 2.75,-10.8; 25 3.25,-10.8; 26 3.75,-10.8; 27 4.25,-10.8; 28 4.75,-10.8; 29 5.25,-10.8; 30 5.75,-10.8; 31 6.25,-10.8; 32 6.75,-10.8; 33 7.25,-10.8; 34 7.75,-10.8; 35 8.25,-10.8; 36 8.75,-10.8; 73 8.75,10.8; 74 8.25,10.8; 75 7.75,10.8; 76 7.25,10.8; 77 6.75,10.8; 78 6.25,10.8; 79 5.75,10.8; 80 5.25,10.8; 81 4.75,10.8; 82 4.25,10.8; 83 3.75,10.8; 84 3.25,10.8; 85 2.75,10.8; 86 2.25,10.8; 87 1.75,10.8; 88 1.25,10.8; 89 0.75,10.8; 90 0.25,10.8; 91 -0.25,10.8; 92 -0.75,10.8; 93 -1.25,10.8; 94 -1.75,10.8; 95 -2.25,10.8; 96 -2.75,10.8; 97 -3.25,10.8; 98 -3.75,10.8; 99 -4.25,10.8; 100 -4.75,10.8; 101 -5.25,10.8; 102 -5.75,10.8; 103 -6.25,10.8; 104 -6.75,10.8; 105 -7.25,10.8; 106 -7.75,10.8; 107 -8.25,10.8; 108 -8.75,10.8 | smd 1.2 x 0.3: 37 10.8,-8.75; 38 10.8,-8.25; 39 10.8,-7.75; 40 10.8,-7.25; 41 10.8,-6.75; 42 10.8,-6.25; 43 10.8,-5.75; 44 10.8,-5.25; 45 10.8,-4.75; 46 10.8,-4.25; 47 10.8,-3.75; 48 10.8,-3.25; 49 10.8,-2.75; 50 10.8,-2.25; 51 10.8,-1.75; 52 10.8,-1.25; 53 10.8,-0.75; 54 10.8,-0.25; 55 10.8,0.25; 56 10.8,0.75; 57 10.8,1.25; 58 10.8,1.75; 59 10.8,2.25; 60 10.8,2.75; 61 10.8,3.25; 62 10.8,3.75; 63 10.8,4.25; 64 10.8,4.75; 65 10.8,5.25; 66 10.8,5.75; 67 10.8,6.25; 68 10.8,6.75; 69 10.8,7.25; 70 10.8,7.75; 71 10.8,8.25; 72 10.8,8.75; 109 -10.8,8.75; 110 -10.8,8.25; 111 -10.8,7.75; 112 -10.8,7.25; 113 -10.8,6.75; 114 -10.8,6.25; 115 -10.8,5.75; 116 -10.8,5.25; 117 -10.8,4.75; 118 -10.8,4.25; 119 -10.8,3.75; 120 -10.8,3.25; 121 -10.8,2.75; 122 -10.8,2.25; 123 -10.8,1.75; 124 -10.8,1.25; 125 -10.8,0.75; 126 -10.8,0.25; 127 -10.8,-0.25; 128 -10.8,-0.75; 129 -10.8,-1.25; 130 -10.8,-1.75; 131 -10.8,-2.25; 132 -10.8,-2.75; 133 -10.8,-3.25; 134 -10.8,-3.75; 135 -10.8,-4.25; 136 -10.8,-4.75; 137 -10.8,-5.25; 138 -10.8,-5.75; 139 -10.8,-6.25; 140 -10.8,-6.75; 141 -10.8,-7.25; 142 -10.8,-7.75; 143 -10.8,-8.25; 144 -10.8,-8.75
SOT223-W = smd 1.9 x 1.9: 1 -2.7,-3.1; 3 2.7,-3.1 | smd 1.1 x 1.9: 2 0,-3.1 | smd 6.7 x 1.9: 4 0,3.1
DIP8 = drill 0.813 pad 1.727 octagon: 1 1.27,0; 2 3.81,0; 3 6.35,0; 4 8.89,0; 5 8.89,7.62; 6 6.35,7.62; 7 3.81,7.62; 8 1.27,7.62
SOIC8 = smd 0.635 x 1.27: PIN1 0.635,-0.635; PIN2 1.905,-0.635; PIN3 3.175,-0.635; PIN4 4.445,-0.635; PIN5 4.445,4.445; PIN6 3.175,4.445; PIN7 1.905,4.445; PIN8 0.635,4.445
TRACO = drill 0.7: +VIN1 4.5,17.64; +VIN2 7.04,17.64; +VOUT 27.36,17.64; -VIN1 4.5,2.4; -VIN2 7.04,2.4; -VOUT 22.28,17.64; P$6 27.36,2.4
PN61729-S = drill 0.95 octagon: 1 1.25,4.71; 2 -1.25,4.71; 3 -1.25,2.71; 4 1.25,2.71 | drill 2.3 pad 2.9: S1 -6.02,0; S2 6.02,0
CRYSTAL-3.2-2.5 = smd 1.3 x 1.05: 1 -1.15,-0.925; 2 1.15,-0.925; 3 1.15,0.925; 4 -1.15,0.925
RESONATOR_EPSON_FC_145 = smd 1.1 x 1.8: P$1 -1.55,0; P$2 1.55,0
CT/CN0603 = smd 1 x 1: 1 -1,0; 2 1,0

### Placement (x,y rotation side)
+3.3V  92.25,52.7 270 top
+5V  15.42,10.79 270 top
+12V  10.34,10.79 270 top
AMPSEAL35  13.51,52.7 270 top
C1  24.94,76.83 90 top
C2  30.02,76.83 90 top
C3  19.86,76.83 90 top
C4  57.33,86.36 0 bottom
C5  36.37,38.73 270 top
C6  46.53,89.53 180 bottom
C7  38.91,70.48 90 bottom
C8  38.91,59.05 90 bottom
C9  73.2,40.64 270 top
C10  36.37,45.09 270 top
C11  40.18,45.09 270 top
C12  60.5,46.35 90 top
C13  66.85,46.35 180 top
C14  55.42,46.99 0 top
C15  40.18,38.73 270 top
C16  60.5,40.01 90 top
C17  66.85,40.01 180 top
C18  55.42,40.64 0 top
C19  36.37,32.38 270 top
C20  40.18,32.38 270 top
C21  60.5,33.66 90 top
C22  66.85,33.66 180 top
C23  55.42,34.29 0 top
C24  36.37,26.04 270 top
C25  40.18,26.04 270 top
C26  60.5,27.3 90 top
C27  26.21,38.73 180 bottom
C28  29.39,12.06 90 top
C29  19.23,12.06 270 top
C30  26.21,30.48 180 bottom
C31  66.85,27.3 180 top
C32  55.42,27.94 0 top
C33  36.37,42.55 90 bottom
C34  36.37,29.84 90 bottom
C35  54.15,28.57 90 bottom
C36  91.62,64.77 180 bottom
C37  91.62,67.31 180 bottom
C38  79.55,76.83 0 bottom
C39  79.55,84.45 180 bottom
C40  78.92,68.58 270 top
C41  80.82,48.9 180 bottom
C42  54.15,41.27 90 bottom
C43  68.76,43.18 270 bottom
C44  68.76,36.83 270 bottom
C45  68.76,30.48 270 bottom
C46  68.76,24.13 270 bottom
C47  66.85,90.17 90 bottom
C48  78.28,90.17 90 bottom
C49  89.71,59.05 180 bottom
C50  89.71,61.59 180 bottom
C51  68.12,80.01 180 top
C52  68.12,77.47 180 top
C53  65.58,66.04 90 top
C54  68.12,57.15 90 top
C55  76.38,59.69 270 top
C56  78.92,59.69 270 top
C57  78.92,64.14 90 top
C58  89.71,56.52 180 bottom
C59  89.71,53.98 180 bottom
C60  68.12,78.74 90 bottom
C61  55.42,62.23 0 bottom
C62  60.5,49.53 0 bottom
C63  80.82,42.55 180 bottom
C64  87.17,66.04 90 top
C65  89.71,71.75 90 top
C66  75.11,54.1 90 top
C67  72.57,54.1 90 top
C68  93.52,71.75 90 top
C69  75.74,79.38 90 top
C70  71.93,79.38 90 top
D1  30.02,67.94 270 bottom
D4  30.02,60.33 270 bottom
D5  30.02,52.7 270 bottom
D6  30.02,45.09 270 bottom
D7  13.51,88.27 270 top
ERASE  56.67,67.63 180 top
IC1  43.99,47.62 270 top
IC2  43.99,41.27 270 top
IC3  63.04,45.09 90 bottom
IC4  63.04,38.73 90 bottom
IC5  43.99,34.92 270 top
IC6  63.04,32.38 90 bottom
IC7  43.99,28.57 270 top
IC8  63.04,26.04 90 bottom
IC9  46.53,23.5 270 bottom
IC10  24.31,14.61 0 top
IC11  46.53,36.2 270 bottom
IWIFI  84.71,33.42 270 top
L1  78.92,54.1 270 top
L2  85.9,71.12 180 top
L3  79.55,45.72 90 bottom
L4  74.47,76.2 0 top
LED  92.25,55.88 270 top
OK1  46.53,18.41 270 top
OK2  46.53,12.06 270 top
PTC  28.75,88.27 90 top
R1  55.42,69.85 0 bottom
R2  55.42,62.23 180 top
R3  55.42,58.42 180 top
R4  55.42,50.8 180 top
R5  28.75,45.09 90 top
R6  32.56,45.09 90 top
R7  55.42,43.18 0 top
R8  55.42,45.09 0 top
R9  66.85,43.81 0 top
R10  63.04,46.35 90 top
R11  28.75,38.73 90 top
R12  32.56,38.73 90 top
R13  55.42,36.83 0 top
R14  55.42,38.73 0 top
R15  66.85,37.47 0 top
R16  63.04,40.01 90 top
R17  28.75,32.38 90 top
R18  32.56,32.38 90 top
R19  21.77,40.01 0 bottom
R20  21.77,37.47 0 bottom
R21  21.77,29.21 0 bottom
R22  21.77,31.75 0 bottom
R23  74.14,46.35 0 top
R24  78.28,46.35 180 top
R25  33.83,69.85 270 bottom
R26  33.83,62.23 270 bottom
R27  33.83,54.61 270 bottom
R28  33.83,46.99 270 bottom
R29  37.64,20.32 0 top
R30  55.42,20.32 0 top
R31  60.5,20.32 0 top
R32  37.64,13.97 0 top
R33  37.64,17.78 0 top
R34  55.42,17.78 0 top
R35  55.42,11.43 0 top
R36  37.64,11.43 0 top
R37  60.5,17.78 0 top
R38  60.5,11.43 0 top
R39  60.5,13.97 0 top
R40  55.42,13.97 0 top
R41  55.42,30.48 0 top
R42  10.34,14.61 0 top
R43  55.42,32.38 0 top
R44  66.85,31.11 0 top
R45  63.04,33.66 90 top
R46  28.75,26.04 90 top
R47  32.56,26.04 90 top
R48  55.42,24.13 0 top
R49  55.42,26.04 0 top
R50  66.85,24.77 0 top
R51  63.04,27.3 90 top
R52  15.42,14.61 0 top
R53  87.17,52.7 180 top
R54  76.38,68.58 90 top
R55  92.25,71.75 270 bottom
R56  89.71,71.75 270 bottom
R57  87.17,55.88 180 top
R59  60.5,8.89 0 top
R60  75.11,64.14 90 top
RESET  92.23,63.18 270 top
SJ1  18.59,40.64 270 bottom
SJ2  18.59,36.83 90 bottom
SJ3  18.59,32.38 270 bottom
SJ4  18.59,28.57 90 bottom
T1  22.4,68.58 270 bottom
T2  22.4,60.96 270 bottom
T3  22.4,53.34 270 bottom
T4  22.4,45.72 270 bottom
TVS  23.67,88.27 270 top
U1  71.93,62.87 180 bottom
U3  72.57,87.63 180 bottom
U4  50.34,59.69 270 bottom
U5  50.34,71.12 270 bottom
U6  74.47,38.73 0 top
U$2  32.56,71.75 0 top
WIFI  55.42,8.89 90 top
X1  88.44,81.92 90 top
Y1  79.55,80.64 0 bottom
Y2  88.44,66.04 90 bottom
Z1  89.71,80.64 180 bottom
Z2  89.71,83.19 180 bottom
ZEN  18.59,88.27 270 top

### Tracks (layer width: path | path; a pad name or v marks a point on that pad's centre or on a via)
+3V3  (via drill 0.6, 0.6 pad 1.27)
  Top 0.305: v68.12,75.56 68.12,76.2 | v85.27,59.05 85.9,59.69 | v85.27,61.59 85.9,60.96 | v85.27,64.14 85.9,63.5 | C64.1 87.17,63.5 85.9,62.23
  Bottom 0.305: U1.11 68.18,75.5 v68.12,75.56 C60.1 | U1.125 58.71,62.12 v58.6,62.23 C61.1 | U1.105 64.68,50.43 v64.95,50.16 63.36,50.16 62.73,49.53 C62.1 61.14,49.53 | U1.62 85.21,59.12 v85.27,59.05 85.9,58.42 85.9,55.88 87.81,53.98 C59.1 88.44,53.98 | U1.57 85.25,61.62 v85.27,61.59 87.81,59.05 C49.1 C58.1 | U1.52 85.25,64.11 v85.27,64.14 87.81,61.59 C50.1 | L3.1 79.55,42.87 C63.1 79.87,40.96 v79.55,40.64
  Bottom 0.406: IC9.1 54.15,27.3 C35.1 54.15,27.94 v52.88,27.94 | IC11.1 53.83,40.01 C42.1 54.15,40.64 v52.88,40.64 | U$2.+VOUT 59.87,89.39 59.87,86.36 C4.1 57.96,86.36 | IC3.7 68.12,44.45 | v70.66,43.81 70.03,44.45 68.12,44.45 | IC4.7 68.12,38.1 | v70.66,37.47 70.03,38.1 68.12,38.1 | IC6.7 68.12,31.75 | v70.66,31.11 70.03,31.75 68.12,31.75 | IC8.7 68.12,25.4 | v70.66,24.77 70.03,25.4 68.12,25.4 | C43.1 68.12,44.13 68.12,44.45 | C44.1 68.12,37.78 68.12,38.1 | C45.1 68.12,31.43 68.12,31.75 | C46.1 68.12,25.08 68.12,25.4 | C47.1 66.85,84.45 v71.3,84.45
  Bottom 1.27: v72.57,84.45 U3.2 | v77.47,24.13 v77.47,20.95
  other vias: 75.11,84.45 73.84,84.45 70.03,84.45
  pour Top: 47.8,100.33 97.16,100.33 97.16,0 47.8,0
+5V  (via drill 0.6 pad 1.27)
  Top 0.406: C28.1 26.62,11.12 IC10.3 26.62,14.61 | R52.2 26.62,14.61 | 26.62,14.61 26.85,14.61 26.85,10.79 | 26.85,5.71 45.26,5.71 45.26,27.94 | 45.26,27.94 45.26,29.21 | 45.26,29.21 45.26,34.29 | 45.26,34.29 45.26,40.64 | 45.26,41.91 45.26,46.99 IC1.1 40.69,46.99 C11.1 | 45.26,40.64 IC2.1 40.18,40.64 C15.1 | 45.26,34.29 IC5.1 40.69,34.29 C20.1 | 45.26,27.94 IC7.1 40.18,27.94 C25.1 40.18,27.3 | v42.72,41.91 45.26,41.91 | 45.26,41.91 45.26,40.64 | v42.72,29.21 45.26,29.21
  Top 0.813: AMPSEAL35.24 2.18,72.7 2.18,68.7 | 2.18,68.7 2.18,64.7 | 2.18,64.7 2.18,60.7 | 2.18,60.7 2.18,56.7 | AMPSEAL35.25 2.18,68.7 | AMPSEAL35.26 2.18,64.7 | AMPSEAL35.27 2.18,60.7 | AMPSEAL35.28 2.18,56.7 | 2.18,56.7 2.18,5.71 26.85,5.71 26.85,10.79 26.85,11.43
  Bottom 0.406: C34.1 36.37,28.57 37.64,27.3 IC9.8 42.09,28.57 v42.72,29.21 | C33.1 36.37,41.27 37.64,40.01 IC11.8 42.09,41.27 v42.72,41.91
+12V  (via drill 0.6 pad 1.27)
  Top 0.203: 7.16,38.73 3.35,38.73 | 13.51,64.77 7.8,64.77 | 13.51,52.7 7.8,52.7
  Top 1.016: R42.2 10.97,14.61
  Bottom 0.406: U5.8 38.91,69.85 C7.1 | U4.8 38.91,58.42 C8.1
  Bottom 1.27: v5.89,7.62 v5.89,3.81
  pour Top: 0,100.33 45.26,100.33 45.26,0 0,0
A0  (via drill 0.6 pad 1.27)
  Top 0.406: R50.2 C31.1 v70.66,27.3
  Bottom 0.305: U1.78 78.18,34.83 v70.66,27.3
  Bottom 0.406: IC8.6 70.03,26.67 v70.66,27.3
A1  (via drill 0.6 pad 1.27)
  Top 0.406: R44.2 C22.1 v70.66,33.66
  Bottom 0.305: U1.79 77.68,40.67 v70.66,33.66
  Bottom 0.406: IC6.6 70.03,33.02 v70.66,33.66
A2  (via drill 0.6 pad 1.27)
  Top 0.406: R15.2 C17.1 v70.66,40.01
  Bottom 0.305: U1.80 77.18,45.26 71.93,40.01 v70.66,40.01
  Bottom 0.406: IC4.6 70.03,39.37 v70.66,40.01
A3  (via drill 0.6 pad 1.27)
  Top 0.406: R9.2 C13.1 v70.66,46.35
  Bottom 0.305: U1.81 76.68,49.84 73.2,46.35 v70.66,46.35
  Bottom 0.406: IC3.6 70.03,45.72 v70.66,46.35
AIN1
  Top 0.406: AMPSEAL35.20 23.83,42.7 27.48,46.35 28.43,46.35 R5.2
AIN2
  Top 0.406: AMPSEAL35.21 23.64,38.7 24.94,40.01 28.43,40.01 R11.2
AIN3
  Top 0.406: AMPSEAL35.22 23.89,34.7 24.94,33.66 28.75,33.66 R17.2 28.75,33.02
AIN4
  Top 0.406: AMPSEAL35.23 24.08,30.7 27.48,27.3 28.75,27.3 R46.2 28.75,26.67
AVREF
  Bottom 0.305: U1.75 79.68,48.39 | 79.68,48.39 79.55,48.26 L3.2 | C41.1 79.87,48.58 79.68,48.39
CANH0
  Bottom 0.406: AMPSEAL35.9 13.9,41.09 SJ1.1 31.48,41.09 35.1,37.47 IC11.7
CANH1
  Bottom 0.406: AMPSEAL35.11 13.51,32.38 13.96,32.84 SJ3.1 28.3,32.84 36.37,24.77 IC9.7
CANL0
  Bottom 0.406: AMPSEAL35.10 13.84,36.38 SJ2.1 32.38,36.38 33.83,34.92 IC11.6
CANL1
  Bottom 0.406: AMPSEAL35.12 14.09,28.12 SJ4.1 27.93,28.12 33.83,22.23 IC9.6
CANRX0  (via drill 0.6)
  Top 0.203: v72.76,68.39 v70.85,66.48
  Bottom 0.203: IC11.2 49.07,37.47 48.44,38.1 48.44,72.07 48.76,72.39 61.77,72.39 64.31,69.85 65.9,69.85 69.27,66.48 v70.85,66.48 | U1.24 74.68,70.31 v72.76,68.39
CANRX1  (via drill 0.6)
  Top 0.203: v80.57,56.71 80.64,56.74 80.7,56.71 84.34,53.06 84.34,46.33 89.97,40.7 89.97,27.62 84.89,22.54 55.74,22.54 v55.42,22.23
  Bottom 0.203: U1.76 79.18,55.83 v80.57,56.71 | v55.42,22.23 55.42,22.86 53.52,24.77 IC9.2
CANTX0  (via drill 0.6)
  Top 0.203: v71.74,69.41 v69.84,67.5
  Bottom 0.203: IC11.3 48.76,34.92 47.8,35.88 47.8,72.39 48.44,73.03 62.09,73.03 63.68,71.44 65.9,71.44 v69.84,67.5 | U1.23 74.18,71.85 v71.74,69.41
CANTX1  (via drill 0.6)
  Top 0.203: v63.36,56.83 60.44,56.83 v58.85,55.24
  Bottom 0.203: U1.140 62.01,69.61 68.12,63.5 68.12,61.59 v63.36,56.83 | v58.85,55.24 55.42,51.82 55.42,24.07 56.57,22.92 56.57,21.27 55.74,20.45 54.34,20.45 52.56,22.23 IC9.3
D6  (via drill 0.6)
  Top 0.305: v63.04,64.14 63.04,62.03 56.44,55.42 56.37,55.35 R4.1
  Bottom 0.305: U1.132 62.2,65.61 63.04,64.77 v63.04,64.14
D7  (via drill 0.6)
  Top 0.305: R3.1 56.69,58.42 61.14,62.87 61.14,65.41 62.41,66.67 v63.04,66.67
  Bottom 0.305: U1.133 62.33,66.11 v63.04,66.67
D8  (via drill 0.6)
  Top 0.305: R2.1 56.69,62.23 58.73,64.26 v58.73,65.53
  Bottom 0.305: U1.134 59.81,66.61 v58.73,65.53
D9
  Bottom 0.305: U1.135 59.11,67.11 R1.1
D13  (via drill 0.6)
  Top 0.305: v84.63,55.88 R57.2
  Bottom 0.305: U1.68 84.4,56.12 v84.63,55.88
D18
  Bottom 0.203: U1.4 64.68,76.15 63.04,77.79 63.04,92.71 65.9,95.57 92.73,95.57 95.29,93.03 95.29,34.45 91.73,30.9 84.7,30.9 84.7,30.87 IWIFI.10
D48  (via drill 0.6)
  Top 0.406: R30.2 v57.96,20.32 R31.1
  Bottom 0.203: U1.97 68.68,49.93 67.96,49.21 63.99,49.21 61.93,47.15 61.93,22.07 60.19,20.32 v57.96,20.32
D49  (via drill 0.6)
  Top 0.406: R34.2 v57.96,17.78 R37.1
  Bottom 0.203: U1.96 69.18,49.8 68.12,48.74 64.15,48.74 62.41,46.99 62.41,20 60.19,17.78 v57.96,17.78
D50  (via drill 0.6)
  Top 0.406: R40.2 v57.96,13.97 R39.1
  Bottom 0.203: U1.95 69.68,49.66 68.28,48.26 64.31,48.26 62.88,46.83 62.88,16.67 60.19,13.97 v57.96,13.97
D51  (via drill 0.6)
  Top 0.406: R35.2 v57.96,11.43 R38.1
  Bottom 0.203: U1.94 70.18,49.53 68.44,47.78 64.47,47.78 63.36,46.67 63.36,14.61 60.19,11.43 v57.96,11.43
D+
  Bottom 0.203: Z1.1 88.71,80.38 90.98,78.11 90.98,73.97 R56.1 87.17,72.71 86.08,71.61 U1.37
  Bottom 0.406: Z1.1 85.75,80.64 X1.3
D-
  Bottom 0.203: R55.1 92.25,83.82 91.62,84.45 89.98,84.45 Z2.1 | U1.38 82.1,71.11 81.78,71.44 81.78,73.66 83.68,75.56 83.68,80.61 X1.2
  Bottom 0.406: Z2.1 88.44,83.19 87.17,81.92 84.98,81.92 X1.2
DIN1  (via drill 0.6 pad 1.27)
  Top 0.406: v35.1,20.32 R29.1 37.01,20.32
  Bottom 0.406: AMPSEAL35.32 2.78,40.7 2.08,40.01 2.08,19.68 5.26,16.51 15.42,16.51 19.23,20.32 v35.1,20.32
DIN2  (via drill 0.6 pad 1.27)
  Top 0.406: v30.66,22.23 35.1,17.78 R33.1
  Bottom 0.406: AMPSEAL35.33 3.86,36.7 3.35,36.2 3.35,22.23 7.16,18.41 14.78,18.41 18.59,22.23 v30.66,22.23
DIN3  (via drill 0.6 pad 1.27)
  Top 0.406: AMPSEAL35.34 3.67,32.7 3.35,32.38 3.35,26.67 4.3,25.72 v7.16,25.72 | v22.4,25.72 23.99,25.72 35.74,13.97 R32.1 37.01,13.97
  Bottom 0.406: v7.16,25.72 v22.4,25.72
DIN4  (via drill 0.6 pad 1.27)
  Top 0.406: AMPSEAL35.35 7.35,28.7 12.56,23.5 v14.15,23.5 | v14.15,20.63 26.54,20.63 35.74,11.43 R36.1
  Bottom 0.406: v14.15,23.5 v14.15,20.63
ERASE_S  (via drill 0.6)
  Top 0.406: v53.68,66.04 53.67,66.99 ERASE.P$1
  Bottom 0.305: U1.130 55.1,64.61 v53.68,66.04
GND  (via drill 0.6 pad 1.27)
  Top 0.406: R47.1 C24.2 34.47,25.09 v34.47,23.5 | R18.1 34.47,31.43 | 34.47,31.43 C19.2 38.28,31.43 | R12.1 34.47,37.78 | 34.47,37.78 C5.2 38.28,37.78 | R6.1 34.47,44.13 | C10.2 39.86,44.13 40.18,43.81 | C11.2 40.18,43.81 | 34.47,44.13 v34.47,42.55 | 34.47,37.78 v34.47,36.2 | 34.47,31.43 v34.47,29.84 | 38.28,25.09 v38.28,23.5 | 38.28,31.43 v38.28,29.84 | 38.28,37.78 v38.28,36.2 | 34.47,44.13 C10.2 | C10.2 38.28,44.13 v38.28,42.55 | C10.2 36.37,43.81 | +12V.C 11.61,10.79 v11.61,8.26 | +5V.C 16.69,10.79 v16.69,8.26 | C29.2 v19.23,8.26 | C28.2 v29.39,14.61 | OK2.4 v40.18,10.16 | OK2.2 v40.18,12.7 | OK1.4 v40.18,16.51 | OK1.2 v40.18,19.05 | IC10.4 v24.31,17.14 | C11.2 40.69,43.18 IC1.4 40.18,43.18 C11.2 | 40.18,43.81 41.45,43.81 42.09,44.45 IC1.3 | 38.28,37.78 39.73,37.78 C15.2 | IC2.4 40.69,36.83 C15.2 | IC2.3 42.09,38.1 41.45,37.47 40.31,37.47 C15.2 | 38.28,31.43 39.73,31.43 C20.2 40.18,30.48 | IC5.4 40.18,30.48 | IC5.3 42.09,31.75 41.45,31.11 40.82,31.11 40.18,30.48 | 38.28,25.09 36.69,25.09 36.37,25.4 | 38.28,25.09 39.73,25.09 C25.2 | IC7.4 40.69,24.13 C25.2 | IC7.3 42.09,25.4 41.45,24.77 40.31,24.77 C25.2 | v23.04,17.14 22.72,17.14 22.72,16.83 23.04,16.83 v23.04,17.14 | v23.04,17.14 22.4,17.14
  Top 1.27: C3.2 v19.86,79.38 | C2.2 v30.02,79.38 | 22.4,19.05 26.21,19.05 26.21,16.51 22.4,16.51 22.4,17.14 22.4,19.05
  Top 2.54: ZEN.A v18.59,84.45 v19.86,84.45 v21.13,84.45 v22.4,84.45 v23.67,84.45 TVS.A
  other vias: 23.04,18.41 24.31,18.41 25.58,18.41 25.58,17.14
  pour Bottom: 0,100.33 45.26,100.33 45.26,0 0,0
IGND  (via drill 0.6, 0.6 pad 1.27)
  Top 0.305: C55.2 76.38,58.42 v77.65,57.15 78.92,58.42 C56.2 | C57.2 C40.2 | C53.2 v65.58,68.58 | C54.2 v68.12,59.69 | C66.2 75.11,55.12 72.57,55.12 | C67.2 72.57,55.12 | 72.57,55.12 v70.66,55.12 | C68.2 C65.2 88.44,73.98 X1.S1
  Top 0.406: C14.2 v57.96,46.99 58.28,47.3 C12.2 R10.2 | IC1.5 51.61,43.18 v52.25,42.55 | IC2.5 51.61,36.83 v52.25,36.2 | C18.2 v57.96,40.64 58.28,40.95 C16.2 60.5,40.64 60.82,40.95 R16.2 | IC5.5 51.61,30.48 v52.25,29.84 | IC7.5 51.61,24.13 v52.25,23.5 | C23.2 v57.96,34.29 58.28,34.6 C21.2 60.5,34.29 60.82,34.6 R45.2 | OK1.7 v52.88,19.05 | OK1.5 v52.88,16.51 | OK2.7 v52.88,12.7 | OK2.5 v52.88,10.16 54.15,8.89 WIFI.C | C32.2 v57.96,27.94 58.28,28.25 C26.2 R51.2 | LED.C 93.52,55.88 v93.52,58.42 92.23,58.42 RESET.P$1 | +3.3V.C 93.3,51.22 v93.52,50.8 | C69.2 74.16,80.33 v73.84,80.64 73.52,80.33 C70.2 | C51.2 66.85,80.01 v65.58,78.74 66.85,77.47 C52.2 | R54.1 76.38,67.31 v74.47,67.31 78.92,67.31 C40.2 | C9.2 v73.2,38.1 74.47,36.83 75.11,36.83 | 75.11,36.83 75.74,36.83 | 76.38,36.83 77.65,36.83 | 77.65,36.83 78.92,36.83 | 78.92,36.83 U6.PIN4 | U6.PIN3 77.65,36.83 | U6.PIN2 76.38,36.83 | U6.PIN1 75.11,36.83 | v80.82,36.83 78.92,36.83 | 75.74,36.83 v75.74,35.56 | 76.38,36.83 75.74,36.83 | v72.57,71.75 v76.38,71.75
  Top 1.27: v61.45,82.55 v65.9,82.55 | v93.41,79.38 v91.2,79.38 v87.49,79.38 | v86.36,97.16 v86.36,92.71 | v56.67,67.64 v56.67,74.19
  Bottom 0.203: 68.68,74.85 69,74.85 69.08,74.93 | 83.92,68.11 83.92,67.24 84.01,67.15 | Z1.2 90.71,81.87 90.67,81.92
  Bottom 0.305: U1.12 | U1.12 68.68,74.85 | U1.12 68.68,72.57 | 83.92,68.1 83.92,68.11 U1.44 79.07,68.11 79.07,68.1 | 82.93,67.11 84.01,67.15 84.2,67.16 | U1.46 82.93,67.11 | 82.93,67.11 83.8,67.11 83.8,67.16 | 83.82,63.12 82.8,63.12 | 82.8,63.12 79.73,63.12 | U1.58 81.71,61.12 81.71,61.11 83.92,61.11 | U1.54 82.8,63.12 | U1.74 | U1.74 80.19,53.11 | U1.74 80.19,50.16 | 80.19,50.16 80.19,50.04 80.7,50.67 80.19,50.16 | U1.106 | U1.106 64.19,53.14 | U1.106 64.19,50.76 | U1.126 62.13,62.62 62.13,62.61 59.49,62.61 60.12,62.64 | U1.33 79.18,74.67 79.17,74.68 79.17,72.64 79.15,72.62
  Bottom 0.406: v93.52,58.42 93.84,58.42 | v93.52,50.8 93.52,51.12 | v73.84,80.64 73.2,81.28 | v65.58,78.74 65.58,77.47 | v74.47,67.31 77.65,67.31 | C49.2 93.5,59.05 93.5,58.42
  Bottom 1.27: C4.2
  pour Bottom: 47.8,100.33 97.16,100.33 97.16,0 47.8,0
MASTER-RESET  (via drill 0.6)
  Top 0.305: v80.82,66.67 86.54,66.67 87.17,67.31 C64.2
  Top 0.406: RESET.P$2 92.23,67.31 87.17,67.31
  Bottom 0.305: U1.47 80.88,66.61 v80.82,66.67
MDRIVE1
  Bottom 0.406: T1.1 27.48,70.89 27.48,72.39 33.83,72.39 33.83,71.12 | 33.83,70.48 R25.1 33.83,71.12 | U5.7 36.37,67.31 36.37,71.12 33.83,71.12
MDRIVE2
  Bottom 0.406: T2.1 27.48,63.27 27.48,64.77 33.83,64.77 | 33.83,64.77 R26.1 33.83,62.87 | U5.6 33.83,64.77
MDRIVE3
  Bottom 0.406: T3.1 27.48,55.65 27.48,57.15 33.83,57.15 33.83,55.88 | 33.83,55.88 R27.1 | U4.7 33.83,55.88
MDRIVE4
  Bottom 0.406: T4.1 27.48,48.03 27.48,49.53 33.83,49.53 33.83,48.26 | 33.83,48.26 R28.1 | U4.6 36.37,53.34 36.37,48.26 33.83,48.26
MOSFET1
  Bottom 0.406: D1.C 30.02,68.58 T1.2 19.86,68.58 | 19.86,68.58 T1.4 | AMPSEAL35.15 15.89,62.7 19.23,66.04 19.23,67.94 19.86,68.58
MOSFET2
  Bottom 0.406: D4.C 30.02,60.96 T2.2 19.86,60.96 | 19.86,60.96 T2.4 | AMPSEAL35.16 18.88,58.7 19.23,59.05 19.23,60.33 19.86,60.96
MOSFET3
  Bottom 0.406: AMPSEAL35.17 19.13,54.7 19.86,53.98 19.86,53.9 T3.4 T3.2 30.02,53.34 D5.C
MOSFET4
  Bottom 0.406: AMPSEAL35.18 16.78,50.7 19.23,48.26 19.23,45.8 T4.4 T4.2 30.02,45.72 D6.C
N$1
  Top 0.406: R5.1 29.71,44.13 31.29,45.72 32.25,45.72 R6.2 C10.1 37.96,46.03 38.91,45.09 41.45,45.09 42.09,45.72 IC1.2
N$2
  Top 0.406: R53.1 +3.3V.A
N$3
  Top 0.406: TVS.C 24.94,90.47 | 29.39,90.81 28.75,90.81 PTC.P$2 28.75,90.47 29.39,90.47
  Top 2.54: D7.C ZEN.C 24.94,90.47 29.39,90.47
N$4
  Top 0.406: R52.1 14.37,14.61 +5V.A
N$5
  Top 0.406: U4.1 R3.2
N$6
  Top 0.406: R57.1 LED.A
N$7
  Bottom 0.406: U5.1 R1.2
N$8
  Top 0.406: IC2.7 52.25,39.37 52.88,38.73 R14.1
N$9
  Top 0.406: IC2.6 52.25,38.1 53.52,36.83 R13.1
N$10
  Top 0.406: U5.4 R2.2
N$11
  Top 0.406: U4.4 R4.2
N$12  (via drill 0.6 pad 1.27)
  Top 0.406: R13.2 v57.96,36.83 58.6,37.47 R15.1 C17.2
  Bottom 0.406: v57.96,36.83 59.23,38.1 IC4.2
N$13
  Top 0.406: IC1.7 52.25,45.72 52.88,45.09 R8.1
N$14
  Top 0.406: IC1.6 52.25,44.45 53.52,43.18 R7.1
N$15  (via drill 0.6 pad 1.27)
  Top 0.406: R7.2 v57.96,43.18 58.6,43.81 R9.1 C13.2
  Bottom 0.406: v57.96,43.18 59.23,44.45 IC3.2
N$16  (via drill 0.6 pad 1.27)
  Top 0.406: R8.2 v57.96,45.09 58.28,45.41 C12.1 R10.1
  Bottom 0.406: v57.96,45.09 58.6,45.72 IC3.3
N$17  (via drill 0.6 pad 1.27)
  Top 0.406: R14.2 v57.96,38.73 58.28,39.05 C16.1 R16.1
  Bottom 0.406: v57.96,38.73 58.6,39.37 IC4.3
N$18
  Top 0.406: R11.1 29.71,37.78 31.29,39.37 32.25,39.37 R12.2 C5.1 37.96,39.69 38.91,38.73 41.45,38.73 42.09,39.37 IC2.2
N$19
  Top 0.406: IC5.7 52.25,33.02 52.88,32.38 R43.1
N$20
  Top 0.406: IC5.6 52.25,31.75 53.52,30.48 R41.1
N$21  (via drill 0.6 pad 1.27)
  Top 0.406: R41.2 v57.96,30.48 58.6,31.11 R44.1 C22.2
  Bottom 0.406: v57.96,30.48 59.23,31.75 IC6.2
N$22  (via drill 0.6 pad 1.27)
  Top 0.406: R43.2 v57.96,32.38 58.28,32.7 C21.1 R45.1
  Bottom 0.406: v57.96,32.38 58.6,33.02 IC6.3
N$23
  Top 0.406: R17.1 29.71,31.43 31.29,33.02 31.93,33.02 32.56,33.66 R18.2 C19.1 37.96,33.34 38.91,32.38 41.45,32.38 42.09,33.02 IC5.2
N$24
  Bottom 0.406: C27.1 23.04,38.73 | 23.04,38.73 23.04,39.37 22.4,40.01 R19.1 | 23.04,38.73 23.04,37.78 R20.1
N$25
  Top 0.406: IC7.7 52.25,26.67 52.88,26.04 R49.1
N$26
  Bottom 0.406: SJ1.2 20.63,40.19 R19.2
N$27
  Bottom 0.406: SJ2.2 20.95,37.28 21.13,37.47 R20.2
N$28
  Bottom 0.406: SJ4.2 20.63,29.02 R21.2
N$29
  Bottom 0.406: C30.1 23.04,30.48 | 23.04,30.48 23.04,31.75 R22.1 | 23.04,30.48 23.04,29.21 R21.1
N$30
  Bottom 0.406: SJ3.2 20.63,31.93 R22.2
N$31
  Top 0.406: R29.2 OK1.1
N$32
  Top 0.406: R33.2 OK1.3
N$33
  Top 0.406: OK1.8 R30.1
N$34
  Top 0.406: OK1.6 R34.1
N$35
  Top 0.406: IC7.6 52.25,25.4 53.52,24.13 R48.1
N$36
  Top 0.406: OK2.6 R35.1
N$37  (via drill 0.6 pad 1.27)
  Top 0.406: R48.2 v57.96,24.13 58.6,24.77 R50.1 C31.2
  Bottom 0.406: v57.96,24.13 59.23,25.4 IC8.2
N$38
  Top 0.406: OK2.8 R40.1
N$39  (via drill 0.6 pad 1.27)
  Top 0.406: R49.2 v57.96,26.04 58.28,26.36 C26.1 R51.1
  Bottom 0.406: v57.96,26.04 58.6,26.67 IC8.3
N$40
  Top 0.406: R32.2 OK2.1
N$41
  Top 0.406: R46.1 29.71,25.09 31.29,26.67 32.25,26.67 R47.2 C24.1 37.96,26.98 38.91,26.04 41.45,26.04 42.09,26.67 IC7.2
N$43
  Top 0.406: R36.2 OK2.3
N$44
  Top 0.406: R42.1 9.07,14.61 9.07,10.79 +12V.A
N$45  (via drill 0.6 pad 1.27)
  Top 0.203: v64.95,8.89 R59.2
  Bottom 0.203: v64.95,8.89 65.58,8.89 66.85,7.62 74.79,7.62 83.44,16.27 83.46,16.4 83.46,26.67 | 83.46,26.67 83.59,27.13 83.57,27.13 | IWIFI.12 83.57,26.69 83.46,26.67
N$46
  Top 0.406: WIFI.A R59.1
N$49
  Top 0.203: IWIFI.5 IWIFI.7
N$53
  Bottom 0.203: U1.43 90.06,68.61 R55.2
N$56
  Bottom 0.203: U1.42 88.03,69.11 R56.2
N$59  (via drill 0.6)
  Top 0.305: v77.01,63.5 75.74,63.5 75.43,63.19 R60.1
  Bottom 0.305: U1.53 77.13,63.62 v77.01,63.5
RX2
  Bottom 0.203: U1.5 65.18,76.28 63.68,77.79 63.68,92.39 66.22,94.93 92.61,94.93 94.88,92.66 94.88,38.84 92.06,36.02 84.66,36.02 IWIFI.4
SCL  (via drill 0.6)
  Top 0.305: v73.2,49.53 73.84,49.53 75.11,48.26 75.11,46.67 R23.2
  Top 0.406: U6.PIN6 77.65,43.81 76.38,45.09 76.06,45.09 R23.2
  Bottom 0.305: U1.87 73.68,50.01 v73.2,49.53
SDA  (via drill 0.6)
  Top 0.305: v75.11,50.16 77.01,48.26 77.01,46.67 R24.2
  Top 0.406: U6.PIN5 78.92,43.81 77.65,45.09 77.65,46.35 R24.2
  Bottom 0.305: U1.86 74.18,51.09 v75.11,50.16
TX2
  Bottom 0.203: U1.6 65.68,76.42 64.31,77.79 64.31,92.08 66.53,94.3 92.57,94.3 94.47,92.39 94.47,39.37 92.25,37.15 86.19,37.15 86.12,37.15 86.11,37.19 86.11,37.16 IWIFI.3
V_IN
  Top 0.406: D7.A 13.51,85.72
  Top 2.54: AMPSEAL35.1 13.51,85.72
VBG  (via drill 0.6)
  Top 0.305: R54.2 78.6,69.53 | 78.92,69.85 C40.1 78.6,69.53 | v80.82,69.22 78.92,69.22 78.6,69.53 | 78.6,69.53 78.28,69.85
  Bottom 0.305: U1.40 81.72,70.11 v80.82,69.22
VBUS
  Bottom 0.203: U1.39 81.96,70.61 81.14,71.44 81.14,73.98 82.09,74.93 82.09,81.53 X1.1
  Bottom 1.27: X1.1 83.73,89.22 C48.1 75.27,89.22 U3.3
VDDANA  (via drill 0.6)
  Top 0.305: v82.09,52.07 81.03,53.14 78.87,53.14 78.87,53 | 78.87,53 75.15,53 75.11,53.34 75.42,53.66 C66.1 C67.1 | L1.2 78.87,53
  Bottom 0.305: U1.73 v82.09,52.06 v82.09,52.07
VDDOUT  (via drill 0.6)
  Top 0.305: 70.66,76.2 70.66,71.75 70.03,71.12 v68.12,71.12 68.12,67.31 65.58,64.77 | v73.2,60.96 73.52,60.64 C55.1 C56.1 79.24,60.96 79.55,60.96 | v80.82,59.69 79.55,60.96 | 79.55,60.96 v80.82,62.23 79.87,63.19 79.55,63.19 | C57.1 79.55,63.19 | v80.82,65.41 80.82,64.45 79.55,63.19 | C54.1 67.17,56.2 v65.58,54.61 65.58,61.47 v64.82,62.23 65.58,62.99 65.58,64.77 | C53.1 65.58,64.77
  Top 0.406: C51.1 C52.1 70.34,76.2 70.66,76.2 L4.1
  Bottom 0.305: U1.10 67.68,71.56 v68.12,71.12 73.2,66.04 v73.2,60.96 | U1.124 64.21,61.62 v64.82,62.23 | U1.104 65.18,54.21 v65.58,54.61 | U1.61 80.9,59.62 v80.82,59.69 | U1.56 80.94,62.12 v80.82,62.23 | U1.45 79.86,67.61 79.55,67.31 79.55,66.04 80.19,65.41 v80.82,65.41
VDDOUTMI  (via drill 0.6 pad 1.27)
  Top 0.203: 84.81,70.8 84.95,71.12 L2.2 84.63,71.12
  Top 0.305: 84.81,70.8 v84.81,70.17 88.12,70.17 88.76,70.81 C65.1 C68.1
  Bottom 0.305: U1.41 84.26,69.61 v84.81,70.17
VDDPLL  (via drill 0.6)
  Top 0.305: v80.19,71.75 80.02,71.75 L4.2
  Top 0.406: L4.2 75.74,76.37 C69.1 C70.1
  Bottom 0.305: U1.34 79.68,72.26 v80.19,71.75
XIN
  Bottom 0.305: U1.36 80.68,76.56 C38.1 80.95,79.47 Y1.1
XIN32
  Bottom 0.305: Y2.P$2 91.02,67.59 C37.1
  Bottom 0.406: U1.48 85.88,66.11 87.33,67.56 88.44,67.56 Y2.P$2
XOUT
  Bottom 0.305: U1.35 80.18,74.94 79.55,75.56 79.55,80.64 78.28,81.92 | 78.28,81.92 78.28,81.45 | 78.28,81.92 78.28,83.82 78.15,83.95 C39.1 | 78.28,81.28 78.28,81.45 | 78.28,81.45 Y1.3
XOUT32
  Bottom 0.305: Y2.P$1 91.02,64.49 C36.1
  Bottom 0.406: U1.49 86.05,65.61 87.17,64.49 Y2.P$1

### Text on the board
tNames: U6
tStop: GEVCU | by | Paulo Almeida